# EAGLE design Turnouts_R2 (EAGLE 9.4.2)

## Sheet 1 of 2
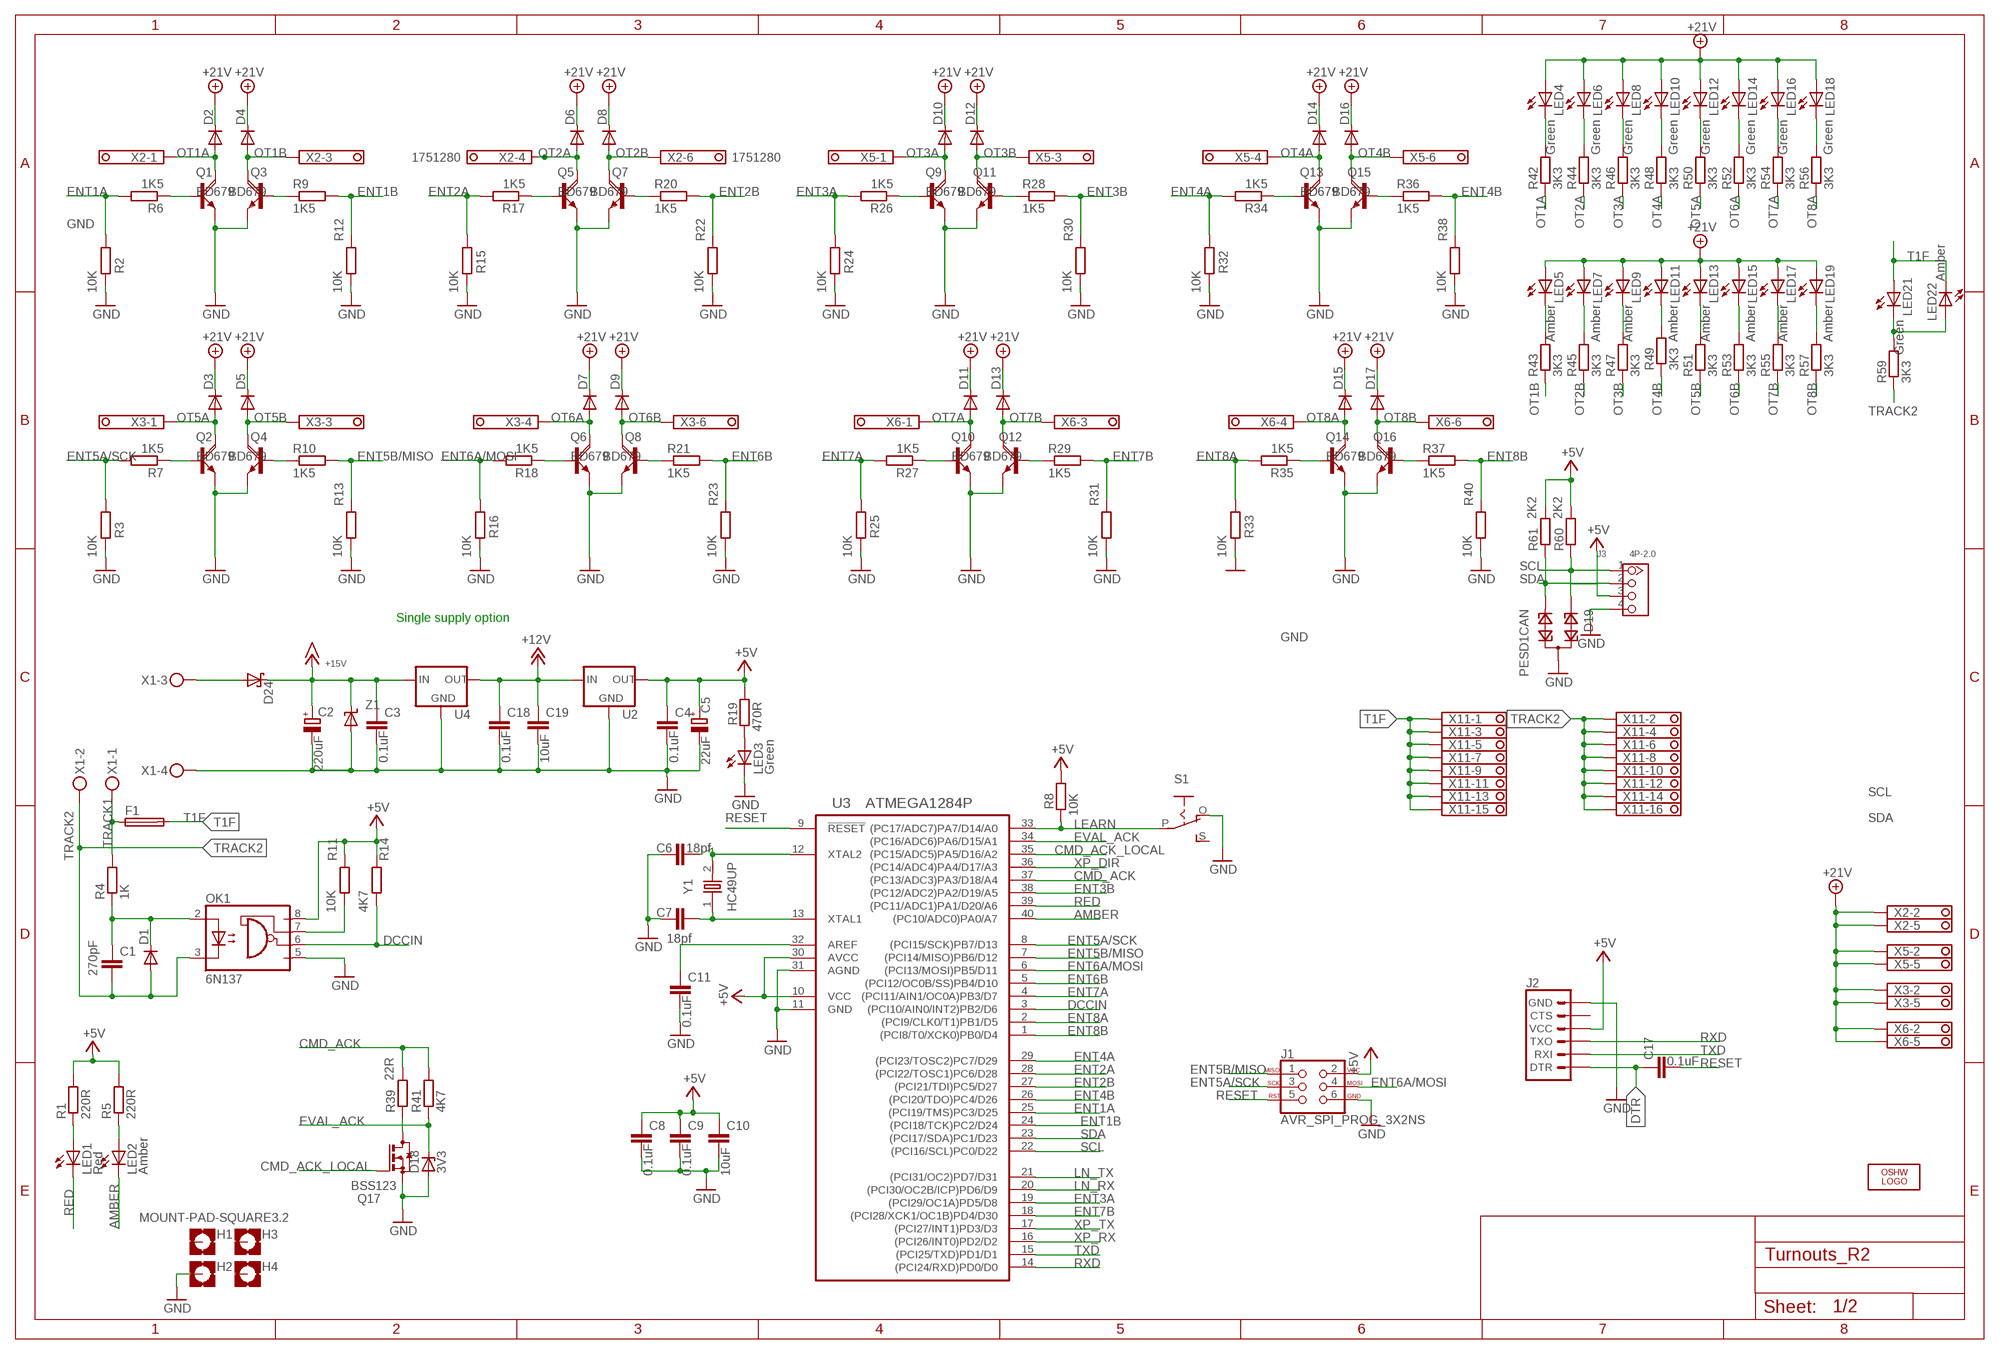
[diagram p0: schematic, sheet 1]

### Parts
C1  270pF  C-EUC0805  [C0805]
C2  220uF  CPOL-EUE7.5-16  [E7,5-16]
C3  0.1uF  C-EUC0805  [C0805]
C4  0.1uF  C-EUC0805  [C0805]
C5  22uF  CPOL-EUE2.5-5  [E2,5-5]
C6  18pf  C-EUC0603  [C0603]
C7  18pf  C-EUC0603  [C0603]
C8  0.1uF  C-EUC0805  [C0805]
C9  0.1uF  C-EUC0805  [C0805]
C10  10uF  C-EUC0805  [C0805]
C11  0.1uF  C-EUC0805  [C0805]
C17  0.1uF  C-EUC0805  [C0805]
C18  0.1uF  C-EUC0805  [C0805]
C19  10uF  C-EUC0805  [C0805]
D1  CGRM4002-G  [SOD-123_MINI-SMA]
D2  CGRM4002-G  [SOD-123_MINI-SMA]
D3  CGRM4002-G  [SOD-123_MINI-SMA]
D4  CGRM4002-G  [SOD-123_MINI-SMA]
D5  CGRM4002-G  [SOD-123_MINI-SMA]
D6  CGRM4002-G  [SOD-123_MINI-SMA]
D7  CGRM4002-G  [SOD-123_MINI-SMA]
D8  CGRM4002-G  [SOD-123_MINI-SMA]
D9  CGRM4002-G  [SOD-123_MINI-SMA]
D10  CGRM4002-G  [SOD-123_MINI-SMA]
D11  CGRM4002-G  [SOD-123_MINI-SMA]
D12  CGRM4002-G  [SOD-123_MINI-SMA]
D13  CGRM4002-G  [SOD-123_MINI-SMA]
D14  CGRM4002-G  [SOD-123_MINI-SMA]
D15  CGRM4002-G  [SOD-123_MINI-SMA]
D16  CGRM4002-G  [SOD-123_MINI-SMA]
D17  CGRM4002-G  [SOD-123_MINI-SMA]
D18  3V3  ZENER-DIODESOT23  [SOT23]
D19  PESD1CAN  [SOT23]
D24  MICROSMD-SCHOTTKY-DIODESMP  [SMP]
F1  TE5  [TE5]
H1  MOUNT-PAD-SQUARE3.2  [3,2-PAD-SQUARE]
H2  MOUNT-PAD-SQUARE3.2  [3,2-PAD-SQUARE]
H3  MOUNT-PAD-SQUARE3.2  [3,2-PAD-SQUARE]
H4  MOUNT-PAD-SQUARE3.2  [3,2-PAD-SQUARE]
J1  AVR_SPI_PROG_3X2NS  [2X3-NS]
J2  6_PIN_SERIAL_TARGET  [1X06]
J3  4P-2.0  GROVE-CONNECTOR-DIP(4P-2.0)  [HW4-2.0]
LED1  Red  LED3MM  [LED3MM]
LED2  Amber  LED3MM  [LED3MM]
LED3  Green  LED3MM  [LED3MM]
LED4  Green  LED3MM  [LED3MM]
LED5  Amber  LED3MM  [LED3MM]
LED6  Green  LED3MM  [LED3MM]
LED7  Amber  LED3MM  [LED3MM]
LED8  Green  LED3MM  [LED3MM]
LED9  Amber  LED3MM  [LED3MM]
LED10  Green  LED3MM  [LED3MM]
LED11  Amber  LED3MM  [LED3MM]
LED12  Green  LED3MM  [LED3MM]
LED13  Amber  LED3MM  [LED3MM]
LED14  Green  LED3MM  [LED3MM]
LED15  Amber  LED3MM  [LED3MM]
LED16  Green  LED3MM  [LED3MM]
LED17  Amber  LED3MM  [LED3MM]
LED18  Green  LED3MM  [LED3MM]
LED19  Amber  LED3MM  [LED3MM]
LED21  Green  LED3MM  [LED3MM]
LED22  Amber  LED3MM  [LED3MM]
LOGO1  OSHW_LOGO_6MILX0200-NT  [OSHW_6X200_NOTEXT]
OK1  6N137  [DIL08]
Q1  BD679  [TO126AV]
Q2  BD679  [TO126AV]
Q3  BD679  [TO126AV]
Q4  BD679  [TO126AV]
Q5  BD679  [TO126AV]
Q6  BD679  [TO126AV]
Q7  BD679  [TO126AV]
Q8  BD679  [TO126AV]
Q9  BD679  [TO126AV]
Q10  BD679  [TO126AV]
Q11  BD679  [TO126AV]
Q12  BD679  [TO126AV]
Q13  BD679  [TO126AV]
Q14  BD679  [TO126AV]
Q15  BD679  [TO126AV]
Q16  BD679  [TO126AV]
Q17  BSS123  [SOT23]
R1  220R  R-EU_R0805  [R0805]
R2  10K  R-EU_R0805  [R0805]
R3  10K  R-EU_R0805  [R0805]
R4  1K  R-EU_R0805  [R0805]
R5  220R  R-EU_R0805  [R0805]
R6  1K5  R-EU_R0805  [R0805]
R7  1K5  R-EU_R0805  [R0805]
R8  10K  R-EU_R0805  [R0805]
R9  1K5  R-EU_R0805  [R0805]
R10  1K5  R-EU_R0805  [R0805]
R11  10K  R-EU_R0805  [R0805]
R12  10K  R-EU_R0805  [R0805]
R13  10K  R-EU_R0805  [R0805]
R14  4K7  R-EU_R0805  [R0805]
R15  10K  R-EU_R0805  [R0805]
R16  10K  R-EU_R0805  [R0805]
R17  1K5  R-EU_R0805  [R0805]
R18  1K5  R-EU_R0805  [R0805]
R19  470R  R-EU_R0805  [R0805]
R20  1K5  R-EU_R0805  [R0805]
R21  1K5  R-EU_R0805  [R0805]
R22  10K  R-EU_R0805  [R0805]
R23  10K  R-EU_R0805  [R0805]
R24  10K  R-EU_R0805  [R0805]
R25  10K  R-EU_R0805  [R0805]
R26  1K5  R-EU_R0805  [R0805]
R27  1K5  R-EU_R0805  [R0805]
R28  1K5  R-EU_R0805  [R0805]
R29  1K5  R-EU_R0805  [R0805]
R30  10K  R-EU_R0805  [R0805]
R31  10K  R-EU_R0805  [R0805]
R32  10K  R-EU_R0805  [R0805]
R33  10K  R-EU_R0805  [R0805]
R34  1K5  R-EU_R0805  [R0805]
R35  1K5  R-EU_R0805  [R0805]
R36  1K5  R-EU_R0805  [R0805]
R37  1K5  R-EU_R0805  [R0805]
R38  10K  R-EU_R0805  [R0805]
R39  22R  R-EU_R0805  [R0805]
R40  10K  R-EU_R0805  [R0805]
R41  4K7  R-EU_R0805  [R0805]
R42  3K3  R-EU_R0805  [R0805]
R43  3K3  R-EU_R0805  [R0805]
R44  3K3  R-EU_R0805  [R0805]
R45  3K3  R-EU_R0805  [R0805]
R46  3K3  R-EU_R0805  [R0805]
R47  3K3  R-EU_R0805  [R0805]
R48  3K3  R-EU_R0805  [R0805]
R49  3K3  R-EU_R0805  [R0805]
R50  3K3  R-EU_R0805  [R0805]
R51  3K3  R-EU_R0805  [R0805]
R52  3K3  R-EU_R0805  [R0805]
R53  3K3  R-EU_R0805  [R0805]
R54  3K3  R-EU_R0805  [R0805]
R55  3K3  R-EU_R0805  [R0805]
R56  3K3  R-EU_R0805  [R0805]
R57  3K3  R-EU_R0805  [R0805]
R59  3K3  R-EU_R0805  [R0805]
R60  2K2  R-EU_R0805  [R0805]
R61  2K2  R-EU_R0805  [R0805]
S1  EG1218S  [EG1218]
U2  V_REG_78XX-TO-220  [TO-220-ALT]
U3  ATMEGA1284P  [DIP40]
U4  V_REG_78XX-TO-220  [TO-220-ALT]
X1  MKDSN1,5/4-5,08  [MKDSN1,5/4-5,08]
X2  1751280  [1751280]
X3  1751280  [1751280]
X5  1751280  [1751280]
X6  1751280  [1751280]
X11  MKKDS1/8-3,5  [MKKDS1/8-3,5]
Y1  HC49UP  [HC49UP]
Z1  TRANSZORB  [SMB]

### Nets
+5V: C4.1 C5.+ C8.1 C9.1 C10.1 J1.2 J2.4(VCC) J3.3 OK1.8(VCC) R1.2 R5.2 R8.2 R11.2 R14.2 R19.2 R60.2 R61.2 U2.OUT U3.10(VCC) U3.30(AVCC) ; also sheet 2
+12V: C18.1 C19.1 U2.IN U4.OUT ; also sheet 2
+15V: C2.+ C3.1 D24.C U4.IN Z1.1(C) ; also sheet 2
+21V: D2.C D3.C D4.C D5.C D6.C D7.C D8.C D9.C D10.C D11.C D12.C D13.C D14.C D15.C D16.C D17.C LED4.A LED5.A LED6.A LED7.A LED8.A LED9.A LED10.A LED11.A LED12.A LED13.A LED14.A LED15.A LED16.A LED17.A LED18.A LED19.A X2.2 X2.5 X3.2 X3.5 X5.2 X5.5 X6.2 X6.5 ; also sheet 2
AMBER: LED2.K(C) U3.40((PC10/ADC0)PA0/A7)
CMD_ACK: R39.2 R41.2 U3.37((PC13/ADC3)PA3/D18/A4) ; also sheet 2
CMD_ACK_LOCAL: Q17.1(G) U3.35((PC15/ADC5)PA5/D16/A2)
DCCIN: OK1.6(VO) R14.1 U3.3((PCI10/AIN0/INT2)PB2/D6)
DTR: C17.1 J2.1(DTR)
ENT1A: R2.2 R6.2 U3.25((PCI19/TMS)PC3/D25)
ENT1B: R9.2 R12.2 U3.24((PCI18/TCK)PC2/D24)
ENT2A: R15.2 R17.2 U3.28((PCI22/TOSC1)PC6/D28)
ENT2B: R20.2 R22.2 U3.27((PCI21/TDI)PC5/D27)
ENT3A: R24.2 R26.2 U3.19((PCI29/OC1A)PD5/D8)
ENT3B: R28.2 R30.2 U3.38((PC12/ADC2)PA2/D19/A5)
ENT4A: R32.2 R34.2 U3.29((PCI23/TOSC2)PC7/D29)
ENT4B: R36.2 R38.2 U3.26((PCI20/TDO)PC4/D26)
ENT5A/SCK: J1.3 R3.2 R7.2 U3.8((PCI15/SCK)PB7/D13)
ENT5B/MISO: J1.1 R10.2 R13.2 U3.7((PCI14/MISO)PB6/D12)
ENT6A/MOSI: J1.4 R16.2 R18.2 U3.6((PCI13/MOSI)PB5/D11)
ENT6B: R21.2 R23.2 U3.5((PCI12/OC0B/SS)PB4/D10)
ENT7A: R25.2 R27.2 U3.4((PCI11/AIN1/OC0A)PB3/D7)
ENT7B: R29.2 R31.2 U3.18((PCI28/XCK1/OC1B)PD4/D30)
ENT8A: R33.2 R35.2 U3.2((PCI9/CLK0/T1)PB1/D5)
ENT8B: R37.2 R40.2 U3.1((PCI8/T0/XCK0)PB0/D4)
EVAL_ACK: D18.3(C) R41.1 U3.34((PC16/ADC6)PA6/D15/A1)
GND: C2.- C3.2 C4.2 C5.- C6.1 C7.1 C8.2 C9.2 C10.2 C11.2 C18.2 C19.2 D18.1(A) D19.3 H2.B3,2(MOUNT) J1.6 J2.6(GND) J3.4 LED3.K(C) OK1.5(GND) Q1.E Q2.E Q3.E Q4.E Q5.E Q6.E Q7.E Q8.E Q9.E Q10.E Q11.E Q12.E Q13.E Q14.E Q15.E Q16.E Q17.2(S) R2.1 R3.1 R12.1 R13.1 R15.1 R16.1 R22.1 R23.1 R24.1 R25.1 R30.1 R31.1 R32.1 R33.1 R38.1 R40.1 S1.O U2.GND U3.11(GND) U3.31(AGND) U4.GND X1.4 Z1.2(A) ; also sheet 2
LEARN: R8.1 S1.P U3.33((PC17/ADC7)PA7/D14/A0)
LN_RX: U3.20((PCI30/OC2B/ICP)PD6/D9) ; also sheet 2
LN_TX: U3.21((PCI31/OC2)PD7/D31) ; also sheet 2
N$1: D24.A X1.3
N$2: C1.1 D1.C OK1.2(A) R4.1
N$4: OK1.7(VE) R11.1
N$5: Q5.B R17.1
N$6: LED13.K(C) R51.2
N$7: Q1.B R6.1
N$8: Q7.B R20.1
N$9: LED15.K(C) R53.2
N$11: Q17.3(D) R39.1
N$12: Q9.B R26.1
N$13: LED17.K(C) R55.2
N$14: LED19.K(C) R57.2
N$15: LED5.K(C) R43.2
N$16: LED7.K(C) R45.2
N$17: LED9.K(C) R47.2
N$18: LED11.K(C) R49.2
N$19: LED4.K(C) R42.2
N$21: LED6.K(C) R44.2
N$23: LED8.K(C) R46.2
N$24: LED10.K(C) R48.2
N$25: LED12.K(C) R50.2
N$26: LED14.K(C) R52.2
N$30: LED16.K(C) R54.2
N$31: LED18.K(C) R56.2
N$32: LED21.K(C) LED22.A R59.2
N$34: Q11.B R28.1
N$36: Q13.B R34.1
N$37: Q15.B R36.1
N$39: Q2.B R7.1
N$40: Q3.B R9.1
N$41: Q4.B R10.1
N$42: LED3.A R19.1
N$43: LED1.A R1.1
N$44: LED2.A R5.1
N$45: Q6.B R18.1
N$46: Q8.B R21.1
N$47: Q10.B R27.1
N$48: Q12.B R29.1
N$49: Q14.B R35.1
N$50: Q16.B R37.1
N$52: C6.2 U3.12(XTAL2) Y1.2
N$53: C7.2 U3.13(XTAL1) Y1.1
N$55: C11.1 U3.32(AREF)
OT1A: D2.A Q1.C R42.1 X2.1
OT1B: D4.A Q3.C R43.1 X2.3
OT2A: D6.A Q5.C R44.1 X2.4
OT2B: D8.A Q7.C R45.1 X2.6
OT3A: D10.A Q9.C R46.1 X5.1
OT3B: D12.A Q11.C R47.1 X5.3
OT4A: D14.A Q13.C R48.1 X5.4
OT4B: D16.A Q15.C R49.1 X5.6
OT5A: D3.A Q2.C R50.1 X3.1
OT5B: D5.A Q4.C R51.1 X3.3
OT6A: D7.A Q6.C R52.1 X3.4
OT6B: D9.A Q8.C R53.1 X3.6
OT7A: D11.A Q10.C R54.1 X6.1
OT7B: D13.A Q12.C R55.1 X6.3
OT8A: D15.A Q14.C R56.1 X6.4
OT8B: D17.A Q16.C R57.1 X6.6
RED: LED1.K(C) U3.39((PC11/ADC1)PA1/D20/A6)
RESET: C17.2 J1.5 U3.9(!RESET) ; also sheet 2
RXD: J2.3(TXO) U3.14((PCI24/RXD)PD0/D0)
SCL: D19.1 J3.1 R60.1 U3.22((PCI16/SCL)PC0/D22) ; also sheet 2
SDA: D19.2 J3.2 R61.1 U3.23((PCI17/SDA)PC1/D23) ; also sheet 2
T1F: F1.2 LED21.A LED22.K(C) X11.1 X11.3 X11.5 X11.7 X11.9 X11.11 X11.13 X11.15
TRACK1: F1.1 R4.2 X1.1
TRACK2: C1.2 D1.A OK1.3(C) R59.1 X1.2 X11.2 X11.4 X11.6 X11.8 X11.10 X11.12 X11.14 X11.16
TXD: J2.2(RXI) U3.15((PCI25/TXD)PD1/D1)
XP_DIR: U3.36((PC14/ADC4)PA4/D17/A3) ; also sheet 2
XP_RX: U3.16((PCI26/INT0)PD2/D2) ; also sheet 2
XP_TX: U3.17((PCI27/INT1)PD3/D3) ; also sheet 2
Unconnected: H1.B3,2(MOUNT) H3.B3,2(MOUNT) H4.B3,2(MOUNT) J2.5(CTS) S1.S

### Notes on the sheet
- Single supply option

## Sheet 2 of 2
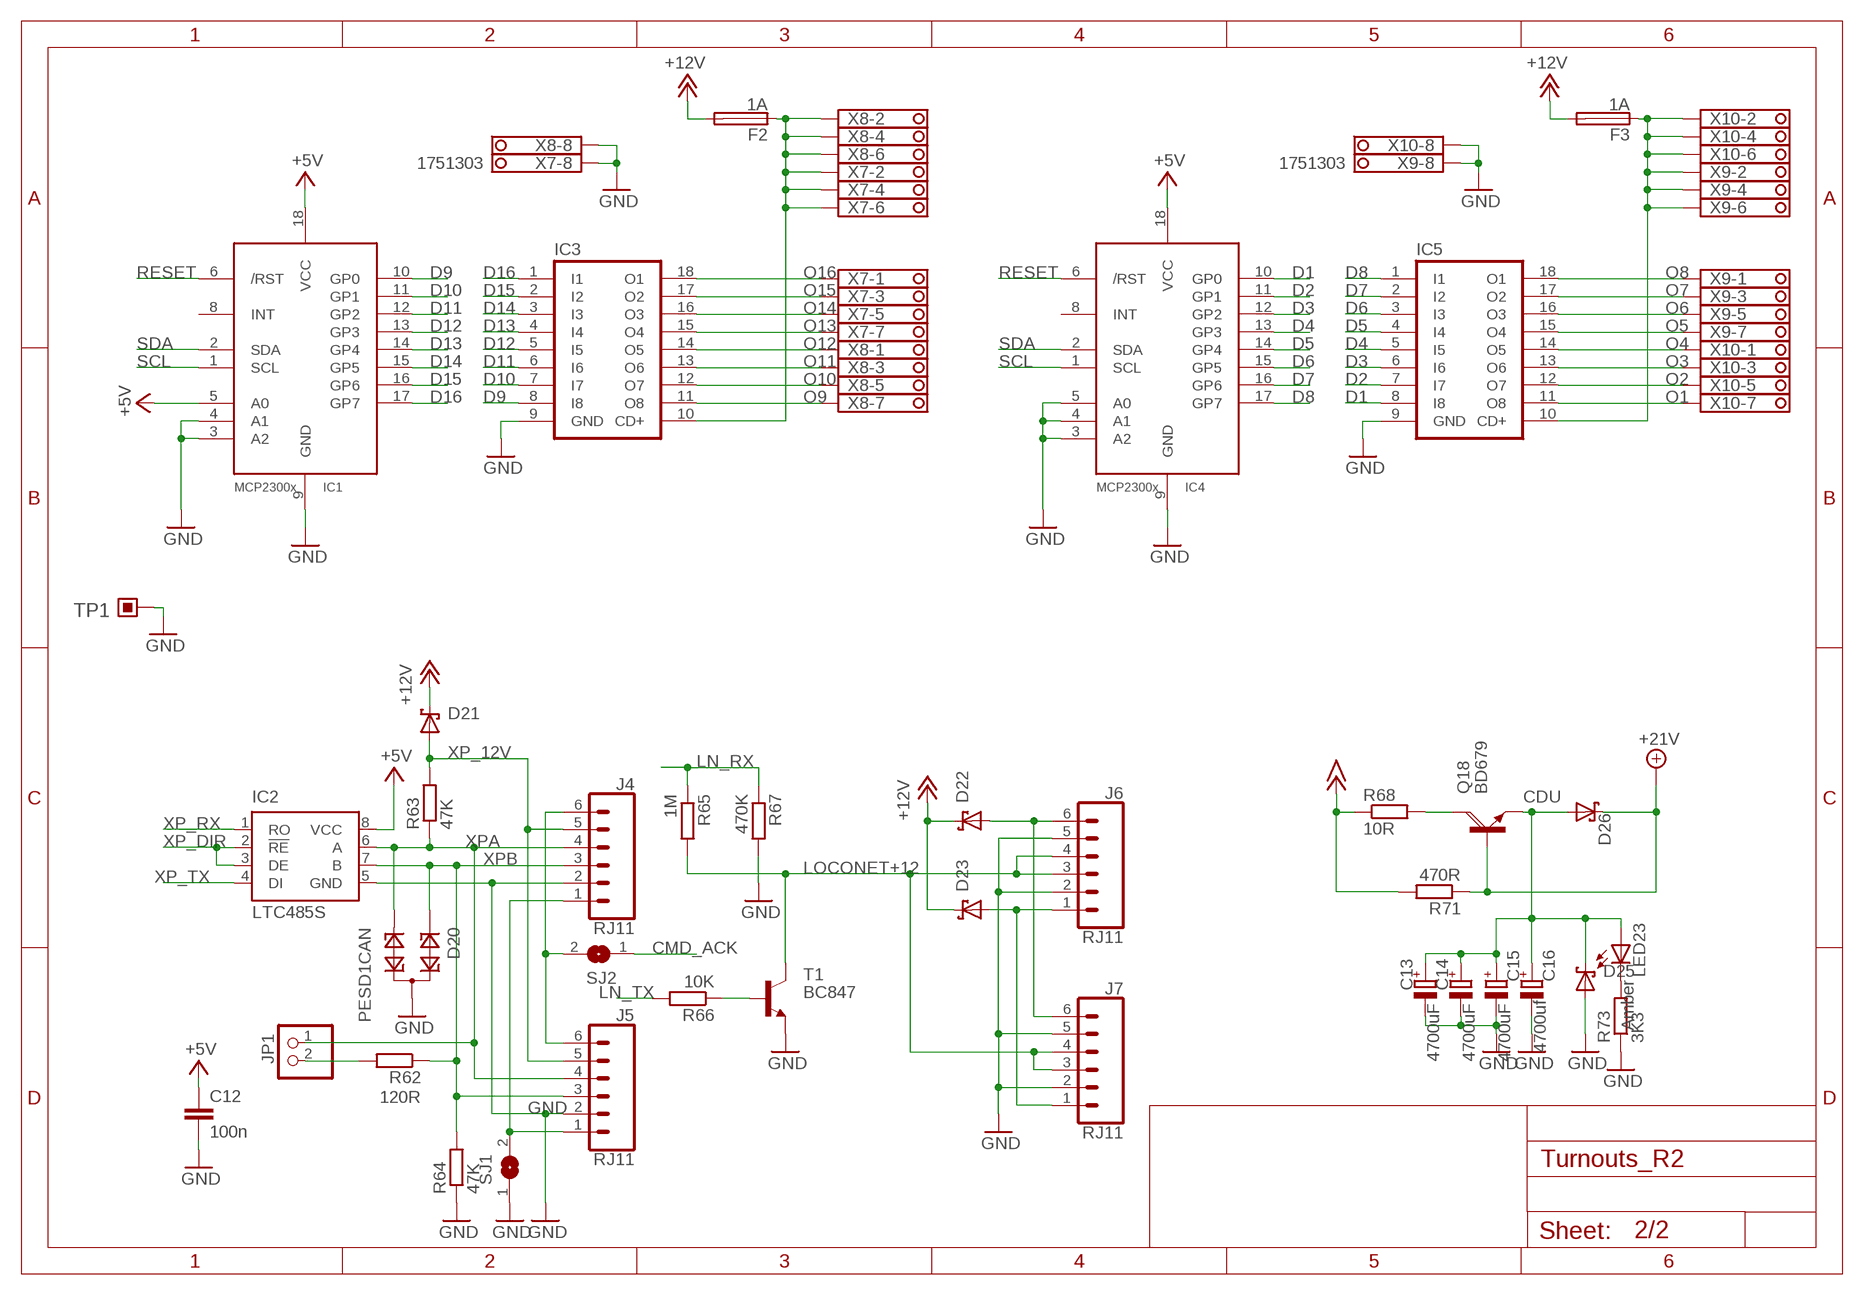
[diagram p1: schematic, sheet 2]

### Parts
C12  100n  C-EUC0805  [C0805]
C13  4700uF  CPOL-EUE7.5-16  [E7,5-16]
C14  4700uF  CPOL-EUE7.5-16  [E7,5-16]
C15  4700uF  CPOL-EUE7.5-16  [E7,5-16]
C16  4700uf  CPOL-EUE7.5-16  [E7,5-16]
D20  PESD1CAN  [SOT23]
D21  MICROSMD-SCHOTTKY-DIODESMP  [SMP]
D22  MICROSMD-SCHOTTKY-DIODESMP  [SMP]
D23  MICROSMD-SCHOTTKY-DIODESMP  [SMP]
D25  MICROSMD-SCHOTTKY-DIODESMP  [SMP]
D26  MICROSMD-SCHOTTKY-DIODESMP  [SMP]
F2  1A  TE5  [TE5]
F3  1A  TE5  [TE5]
IC1  MCP23008/P  [DIL18]
IC2  LTC485S  [SOIC8]
IC3  ULN2803A  [DIL18]
IC4  MCP23008/P  [DIL18]
IC5  ULN2803A  [DIL18]
J4  RJ11  RJ11-6  [RJ11-6]
J5  RJ11  RJ11-6  [RJ11-6]
J6  RJ11  RJ11-6  [RJ11-6]
J7  RJ11  RJ11-6  [RJ11-6]
JP1  PINHD-1X2  [1X02]
LED23  Amber  LED3MM  [LED3MM]
Q18  BD679  [TO126AV]
R62  120R  R-EU_R0805  [R0805]
R63  47K  R-EU_R0805  [R0805]
R64  47K  R-EU_R0805  [R0805]
R65  1M  R-EU_R0805  [R0805]
R66  10K  R-EU_R0805  [R0805]
R67  470K  R-EU_R0805  [R0805]
R68  10R  R-EU_0617/22  [0617/22]
R71  470R  R-EU_0411/12  [0411/12]
R73  3K3  R-EU_R0805  [R0805]
SJ1  SJ  [SJ]
SJ2  SJ  [SJ]
T1  BC847  [SOT23]
TP1  TP1.5RUND  [TP-1.5RUND]
X7  1751303  [1751303]
X8  1751303  [1751303]
X9  1751303  [1751303]
X10  1751303  [1751303]

### Nets
+5V: C12.1 IC1.5(A0) IC1.18(VCC) IC2.8(VCC) IC4.18(VCC) ; also sheet 1
+12V: D21.C D22.C D23.C F2.2 F3.2 ; also sheet 1
+15V: R68.1 R71.2 ; also sheet 1
+21V: D26.C Q18.B R71.1 ; also sheet 1
CDU: C13.+ C14.+ C15.+ C16.+ D25.C D26.A LED23.A Q18.E
CMD_ACK: SJ2.1 ; also sheet 1
D1: IC4.10(GP0) IC5.8(I8)
D2: IC4.11(GP1) IC5.7(I7)
D3: IC4.12(GP2) IC5.6(I6)
D4: IC4.13(GP3) IC5.5(I5)
D5: IC4.14(GP4) IC5.4(I4)
D6: IC4.15(GP5) IC5.3(I3)
D7: IC4.16(GP6) IC5.2(I2)
D8: IC4.17(GP7) IC5.1(I1)
D9: IC1.10(GP0) IC3.8(I8)
D10: IC1.11(GP1) IC3.7(I7)
D11: IC1.12(GP2) IC3.6(I6)
D12: IC1.13(GP3) IC3.5(I5)
D13: IC1.14(GP4) IC3.4(I4)
D14: IC1.15(GP5) IC3.3(I3)
D15: IC1.16(GP6) IC3.2(I2)
D16: IC1.17(GP7) IC3.1(I1)
GND: C12.2 C13.- C14.- C15.- C16.- D20.3 D25.A IC1.3(A2) IC1.4(A1) IC1.9(GND) IC2.5(GND) IC3.9(GND) IC4.3(A2) IC4.4(A1) IC4.5(A0) IC4.9(GND) IC5.9(GND) J4.2 J5.2 J6.2 J6.5 J7.2 J7.5 R64.1 R67.2 R73.1 SJ1.1 T1.2(E) TP1.1 X7.8 X8.8 X9.8 X10.8 ; also sheet 1
LN_RX: R65.1 R67.1 ; also sheet 1
LN_TX: R66.2 ; also sheet 1
LOCONET+12: J6.3 J6.4 J7.3 J7.4 R65.2 T1.3(C)
N$10: J4.1 J5.1 SJ1.2
N$20: LED23.K(C) R73.2
N$22: Q18.C R68.2
N$27: D23.A J6.1 J7.1
N$28: J4.6 J5.6 SJ2.2
N$29: F2.1 IC3.10(CD+) X7.2 X7.4 X7.6 X8.2 X8.4 X8.6
N$33: JP1.2 R62.2
N$38: F3.1 IC5.10(CD+) X9.2 X9.4 X9.6 X10.2 X10.4 X10.6
N$51: D22.A J6.6 J7.6
N$54: R66.1 T1.1(B)
O1: IC5.11(O8) X10.7
O2: IC5.12(O7) X10.5
O3: IC5.13(O6) X10.3
O4: IC5.14(O5) X10.1
O5: IC5.15(O4) X9.7
O6: IC5.16(O3) X9.5
O7: IC5.17(O2) X9.3
O8: IC5.18(O1) X9.1
O9: IC3.11(O8) X8.7
O10: IC3.12(O7) X8.5
O11: IC3.13(O6) X8.3
O12: IC3.14(O5) X8.1
O13: IC3.15(O4) X7.7
O14: IC3.16(O3) X7.5
O15: IC3.17(O2) X7.3
O16: IC3.18(O1) X7.1
RESET: IC1.6(/RST) IC4.6(/RST) ; also sheet 1
SCL: IC1.1(SCL) IC4.1(SCL) ; also sheet 1
SDA: IC1.2(SDA) IC4.2(SDA) ; also sheet 1
XP_12V: D21.A J4.5 J5.5 R63.2
XP_DIR: IC2.2(!RE) IC2.3(DE) ; also sheet 1
XP_RX: IC2.1(RO) ; also sheet 1
XP_TX: IC2.4(DI) ; also sheet 1
XPA: D20.2 IC2.6(A) J4.4 J5.4 JP1.1 R63.1
XPB: D20.1 IC2.7(B) J4.3 J5.3 R62.1 R64.2
Unconnected: IC1.8(INT) IC4.8(INT)

## Library data of the parts
C1 C3 C4 C8-C11 C17-C19 = rcl:C-EU: CAPACITOR, European symbol; SPICEPREFIX: C
C2 C5 = rcl:CPOL-EU: POLARIZED CAPACITOR, European symbol; SPICEPREFIX: C
C6 C7 C12 = rcl:C-EU: CAPACITOR, European symbol
C13-C16 = rcl:CPOL-EU: POLARIZED CAPACITOR, European symbol
D1-D17 = diode:CGRM400*-G: Molded plasitc,JEDEC SOD-123/Mini SMA Source: Comchip CGRM4001-G.pdf
D18 = diode:ZENER-DIODE: Z-Diode
D19 D20 = diode:PESD1CAN: CAN bus ESD protection diode Source: http://www.nxp.com/documents/data_sheet/PESD1CAN.pdf
D21-D26 = GJR:MICROSMD-SCHOTTKY-DIODE: SMP variant; FARNELL: 1812493; MANUFACTURER: Vishay; PARTNUM: SS3PX
F1-F3 = fuse:TE5: FUSE Wickmann; OC_FARNELL: unknown; OC_NEWARK: unknown
H1-H4 = holes:MOUNT-PAD-SQUARE: MOUNTING PAD, square
IC1 IC4 = adafruit:MCP23008: MCP23008 Inexpensive i2c i/o expander - 8 general purpose i/o pins with optional pullups
IC2 = linear-technology:LTC485: Low Power RS485 Interface Transceiver Source: http://www.linear.com/pc/downloadDocument.do?navId=H0,C1,C1007,C1017,P2064,D1718; OC_FARNELL: unknown; OC_NEWARK: unknown
IC3 IC5 = uln-udn:ULN2803A: DRIVER ARRAY
J1 = SparkFun-Connectors:AVR_SPI_PROG_3X2: AVR ISP 6 Pin This is the reduced ISP connector for AVR programming. Common on Arduino. This footprint will take up less PCB space and can be used with a 10-pin to 6-pin adapter such as SKU: BOB-08508 **Special note about "TEST_POINT" package. The stop mask is on the top side, so if you want your programming test points to be on the bottom of your board, make sure to place this package on the bottom side of the board. This also ensure that the orientation to program from the bottom side will be correct. SparkFun Products: SparkFun ISP Pogo Adapter <https://www.sparkfun.com/products/11591> - NS Tiny AVR Programmer <https://www.sparkfun.com/products/11801> -PTH
J2 = SparkFun-Connectors:6_PIN_SERIAL_TARGET: 6-pin header connection for use with the "FTDI BASIC" pinout - TARGET SIDE. Also known as "Arduino Serial Program Header". It is used to mate with our FTDI Basic serial programmers using the Arduino IDE. Note, this device has "TARGET" in the name. It is intended to be used on a design that contains a target micro-controller that you wish to program. The "sister" device, named "CABLE" is inteneded to be used on a design that usually lives on the end of your USB cable and prvides the converter chip (FTDI232 or FTDI231x) to commnicate serial RX/TX. You can populate with some of these: Break Away Headers - Straight <https://www.sparkfun.com/products/116> (PRT-00116) For reference (or to suit your programming needs) check out these designs: SparkFun FTDI Basic Breakout - 5V <https://www.sparkfun.com/products/9716> (DEV-09716) SparkFun FTDI Basic Breakout - 3.3V <https://www.sparkfun.com/products/9873> (DEV-09873) SparkFun FTDI SmartBasic <https://www.sparkfun.com/products/12935> (DEV-12935) SparkFun Beefy 3 - FTDI Basic Breakout <https://www.sparkfun.com/products/13746> (DEV-13746)
J3 = Seeed-Connector:GROVE-CONNECTOR-DIP(4P-2.0): 320110033
J4-J7 = SparkFun-Connectors:RJ11-6: RJ11 Jack - 6 pin Commonly found on CAT3 devices and some Microchip programmers. Here is the connector we sell at SparkFun: RJ11 6-Pin Connector <https://www.sparkfun.com/products/132> (PRT-00132) Datasheet <http://www.sparkfun.com/datasheets/Prototyping/Connectors/RJ11-Datasheet.pdf> It is used on this SparkFun product: SparkFun Weather Shield <https://www.sparkfun.com/products/12081> (DEV-12081) Weather Meters <https://www.sparkfun.com/products/8942> (SEN-08942); PROD_ID: CONN-08590; SF_ID: PRT-00132
JP1 = pinhead:PINHD-1X2: PIN HEADER
LED1-LED19 LED21-LED23 = adafruit:LED: LED OSRAM: - CHIPLED LG R971, LG N971, LY N971, LG Q971, LY Q971, LO R971, LY R971 LH N974, LH R974 LS Q976, LO Q976, LY Q976 LO Q996 - Hyper CHIPLED LW Q18S LB Q993, LB Q99A, LB R99A - SideLED LS A670, LO A670, LY A670, LG A670, LP A670 LB A673, LV A673, LT A673, LW A673 LH A674 LY A675 LS A676, LA A676, LO A676, LY A676, LW A676 LS A679, LY A679, LG A679 - Hyper Micro SIDELED® LS Y876, LA Y876, LO Y876, LY Y876 LT Y87S - SmartLED LW L88C, LW L88S LB L89C, LB L89S, LG L890 LS L89K, LO L89K, LY L89K LS L896, LA L896, LO L896, LY L896 - TOPLED LS T670, LO T670, LY T670, LG T670, LP T670 LSG T670, LSP T670, LSY T670, LOP T670, LYG T670 LG T671, LOG T671, LSG T671 LB T673, LV T673, LT T673, LW T673 LH T674 LS T676, LA T676, LO T676, LY T676, LB T676, LH T676, LSB T676, LW T676 LB T67C, LV T67C, LT T67C, LS T67K, LO T67K, LY T67K, LW E67C LS E67B, LA E67B, LO E67B, LY E67B, LB E67C, LV E67C, LT E67C LW T67C LS T679, LY T679, LG T679 LS T770, LO T770, LY T770, LG T770, LP T770 LB T773, LV T773, LT T773, LW T773 LH T774 LS E675, LA E675, LY E675, LS T675 LS T776, LA T776, LO T776, LY T776, LB T776 LHGB T686 LT T68C, LB T68C - Hyper Mini TOPLED® LB M676 - Mini TOPLED Santana® LG M470 LS M47K, LO M47K, LY M47K Source: http://www.osram.convergy.de/
LOGO1 = ohw-logo:OSHW_LOGO_6MIL
OK1 = optocoupler:6N137: MOTOROLA OPTO COUPLER; MPN: 6N137; OC_FARNELL: 1328376; OC_NEWARK: 52M1895
Q1-Q16 Q18 = transistor-power:BD679: NPN DARLINGTON TRANSISTOR
Q17 = transistor-small-signal:BSS123: N-CHANNEL MOS FET
R1-R57 R59-R68 R71 R73 = rcl:R-EU_: RESISTOR, European symbol
S1 = adafruit:EG1218: SLIDING SWITCH 0.1" spacing through hole, vertical SPDT slide switch http://www.ladyada.net/library/pcb/eaglelibrary.html
SJ1 SJ2 = jumper:SJ: SMD solder JUMPER
T1 = nxp_60:BC847: 45 V, 100 mA NPN general-purpose transistors NPN general-purpose transistor AAL Eindhoven MK
TP1 = RCLDT:TP
U2 U4 = SparkFun-IC-Power:V_REG_78XX: Voltage Regulator Standard 78xx regulator. IGO (Input Ground Output). Spark Fun Electronics SKU : COM-00107; PROD_ID: VREG-08450; SF_ID: COM-00107
U3 = GJR:ATMEGA1284P: ATMEL ATMEGA 1284P; FARNELL: 1972067; MANUFACTURER: Microchip; PARTNUMBER: ATMEGA1284-P
X1 = con-phoenix-508:MKDSN1,5/4-5,08: MKDSN 1,5/ 4-5,08 Printklemme Nennstrom: 13,5 A Nennspannung: 250 V Rastermaß: 5,08 mm Polzahl: 4 Anschlussart: Schraubanschluss Montage: Löten Anschlussrichtung Leiter/Platine: 0 ° Artikelnummer: 1729144 Source: http://eshop.phoenixcontact.com .. 1729144.pdf; MPN: SMKDSN1,5/4-5,08; OC_FARNELL: 1792905; OC_NEWARK: 70R0300
X2 X3 X5 X6 = con-phoenix-350:1751280: MKDS 1/ 6-3,5 Printklemme Nennstrom: 10 A Bemessungsspannung: 160 V Raster: 3,5 mm Polzahl: 6 Montageart: Löten Anschlussart: Schraubanschluss Anschlussrichtung vom Leiter zur Platine: 0° Source: http://eshop.phoenixcontact.com .. 1751280.pdf; MPN: 1751280; OC_FARNELL: unknown; OC_NEWARK: 27R1765
X7-X10 = con-phoenix-350:1751303: MKDS 1/ 8-3,5 Printklemme Nennstrom: 10 A Bemessungsspannung: 160 V Raster: 3,5 mm Polzahl: 8 Montageart: Löten Anschlussart: Schraubanschluss Anschlussrichtung vom Leiter zur Platine: 0° Source: http://eshop.phoenixcontact.com .. .pdf; OC_FARNELL: unknown; OC_NEWARK: unknown
X11 = con-phoenix-350:MKKDS1/8-3,5: MKKDS 1/8-3,5 Artikelnummer: 1751455 Printklemme, Nennstrom: 8 A, Nennspannung: 200 V, Rastermaß: 3,5 mm, Polzahl: 13 Anschlussart: Schraubanschluss, Montage: Löten, Anschlussrichtung Leiter/Platine: 0 °, Farbe: grün Home page <http://www.phoenixcontact.de/>
Y1 = GJR:HC49UP: HC49 SMD Crystal
Z1 = GJR:TRANSZORB; VOLTAGE: 15V

## Net classes
0 default: clearance 0.205 mm
1 pwr: width 0.2 mm, drill 0.3 mm, clearance 0.205 mm to class 0, clearance 0.205 mm
2 gnd: width 0.2 mm, drill 0.3 mm, clearance 0.2 mm

## Board
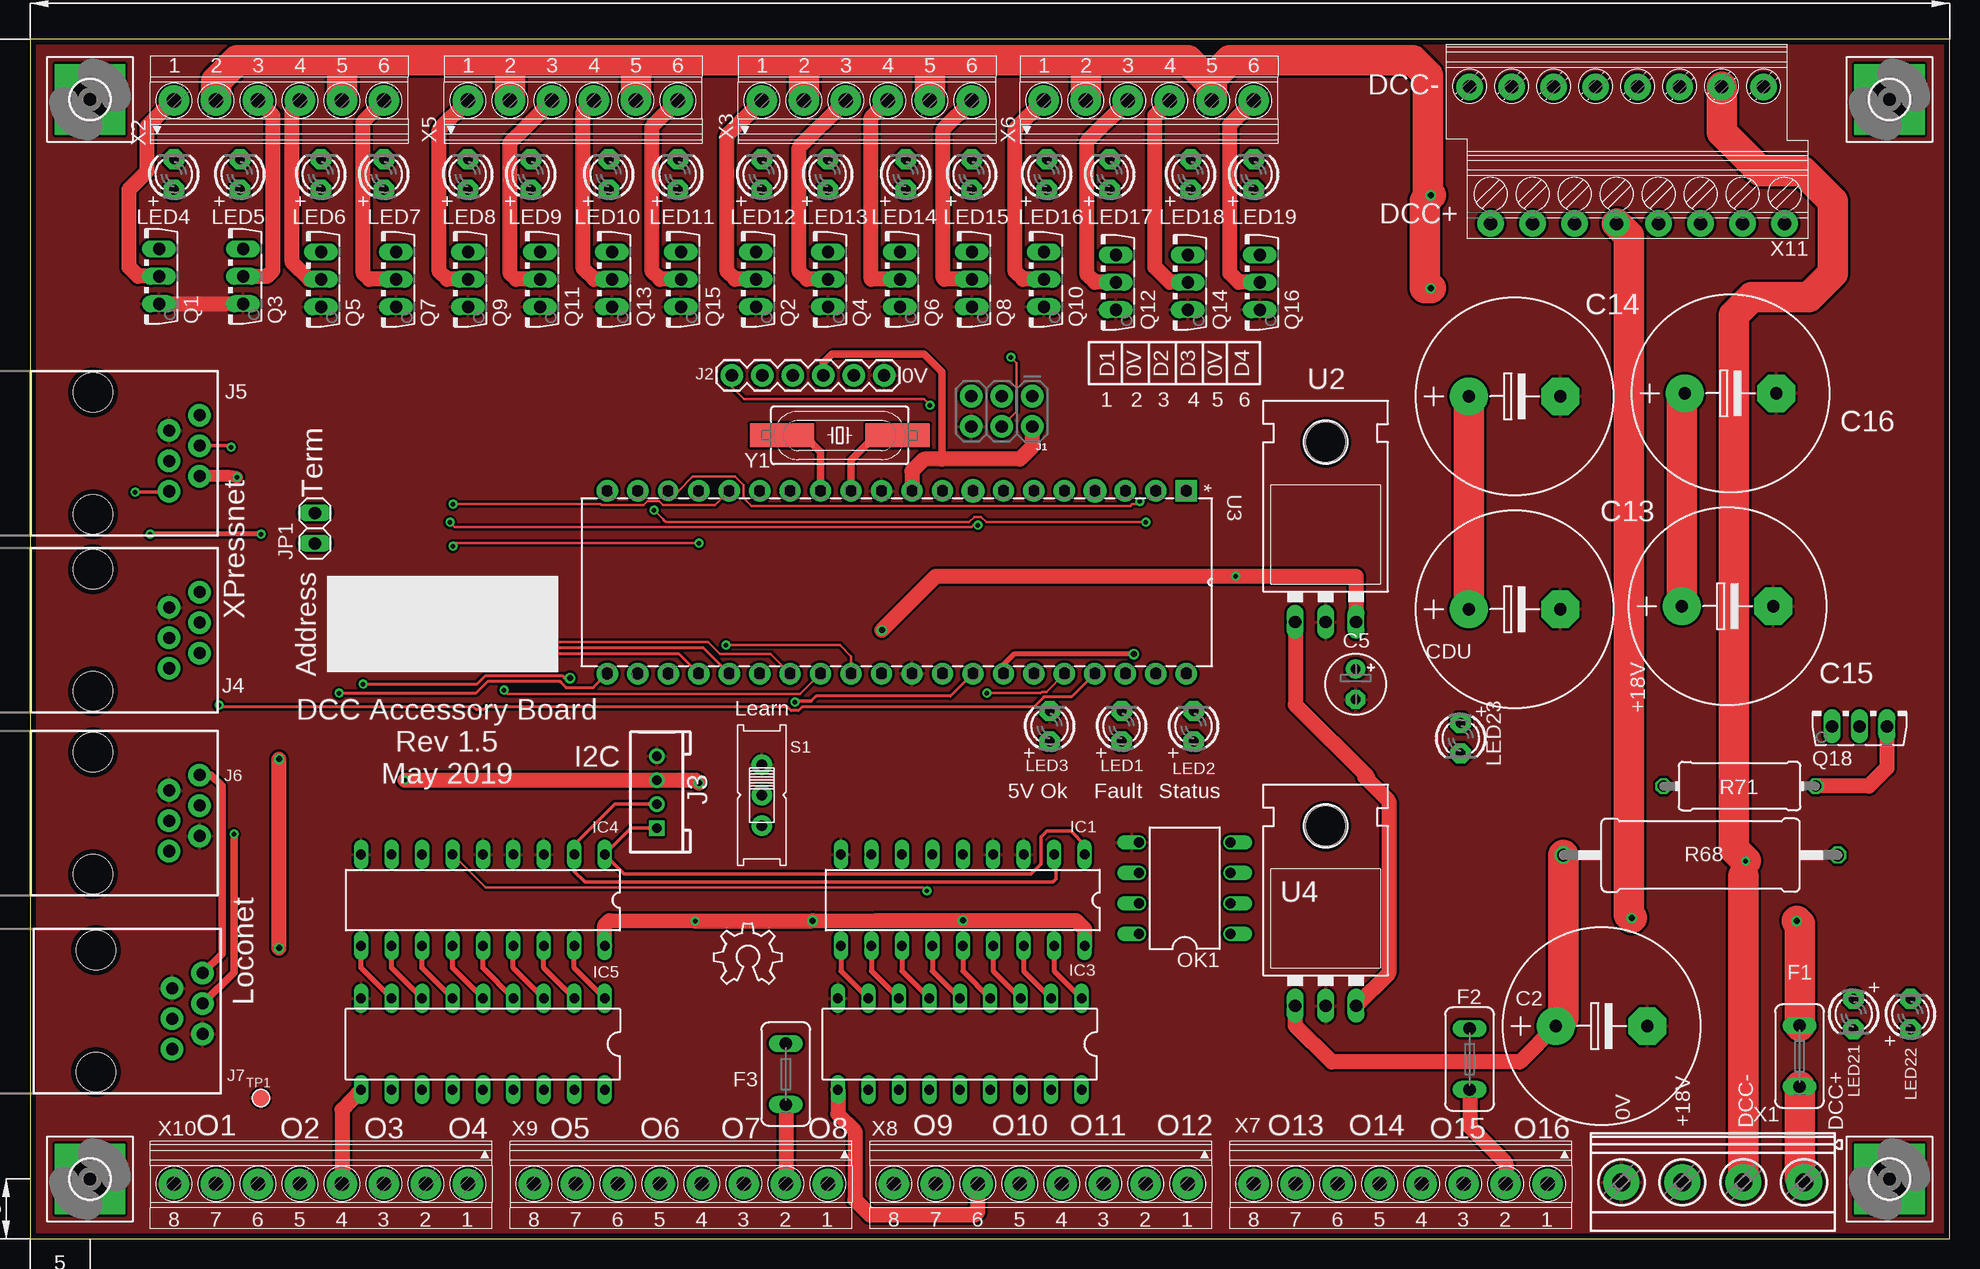
[diagram p2: board, top side]
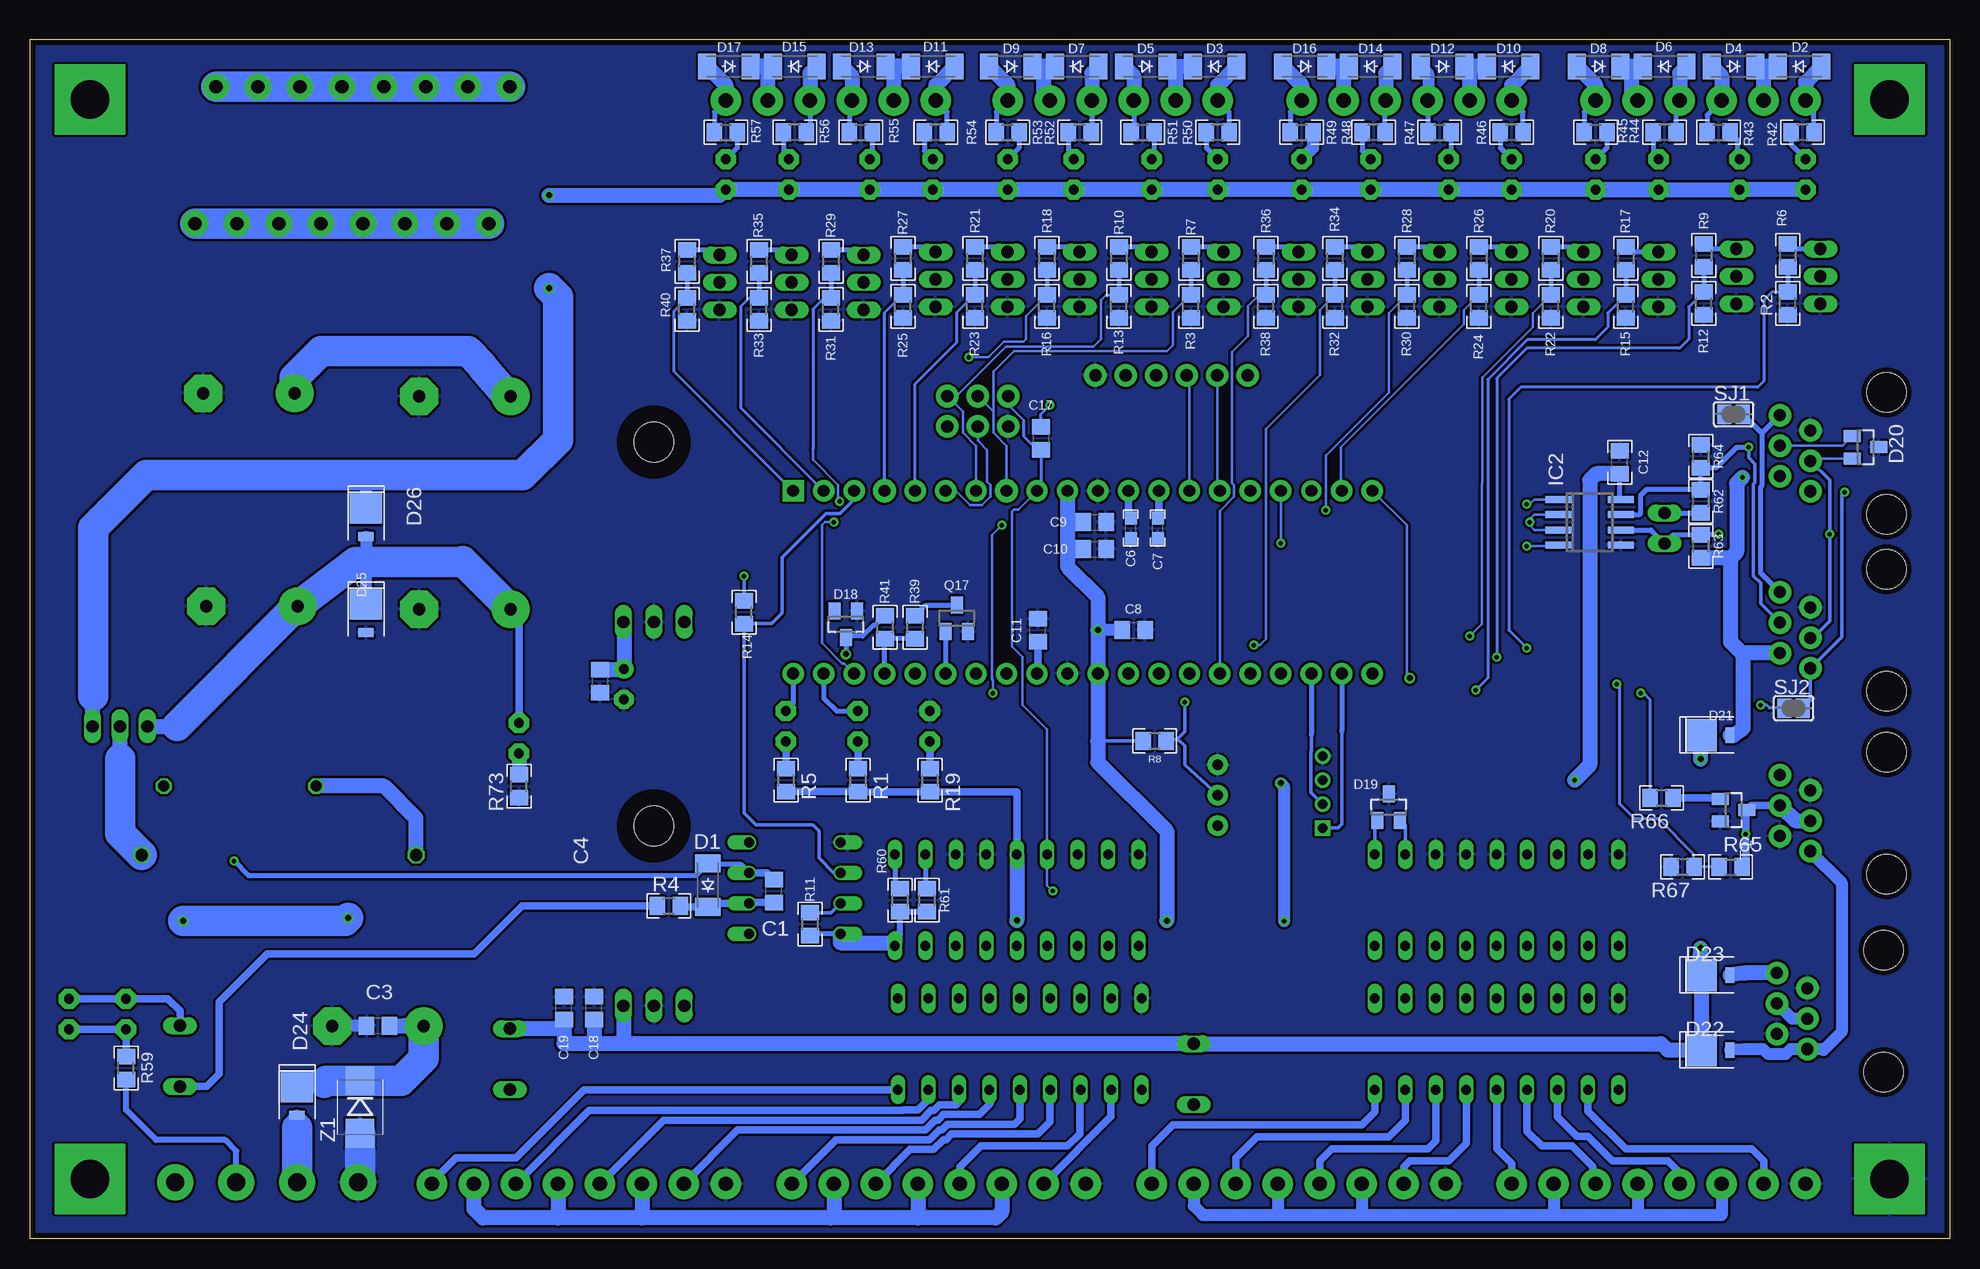
[diagram p3: board, bottom side, seen from below]

Size 160 x 100 mm. Coordinates in mm from the lower left corner, seen from the top.
Outline: 0,0 160,0 160,100 0,100 0,0
Copper layers (1*16): Top 0.035mm / dielectric 1.55mm / Bottom 0.035mm
Design rules "eC-STANDARD_pool-2-layer-35Ê-base-copper": minimum track width 0.15mm, minimum drill 0.25mm, track to track 0.2mm, track to pad 0.2mm, pad to pad 0.2mm, via to via 0.2mm, smd to smd 0.2mm, copper to edge 0.45mm, drill to drill 0.3mm, minimum pad ring 0.2mm, minimum via ring 0.2mm, stop-mask expansion 0.1mm, vias tented up to drill 0mil, thermal gap 0.2mm

### Footprints (pad centres in the part's own frame; a part is rotated, then mirrored left to right if it is on the bottom)
C0805 = smd 1.3 x 1.5: 1 -0.95,0; 2 0.95,0
E7,5-16 = drill 1.016 pad 3.15: + -3.81,0 | drill 1.016 pad 3.15 octagon: - 3.81,0
E2,5-5 = drill 0.813 pad 1.6: + -1.27,0 | drill 0.813 pad 1.6 octagon: - 1.27,0
C0603 = smd 1.1 x 1: 1 -0.85,0; 2 0.85,0
SOD-123_MINI-SMA = smd 1.5 x 2.1: A 1.8,0; C -1.8,0
SOT23 = smd 1 x 1.4: 1 -0.95,-1.1; 2 0.95,-1.1; 3 0,1.1
SMP = smd 0.762 x 1.27: A 0.699,0 | smd 2.54 x 2.7: C -1.653,0
TE5 = drill 1.016 long: 1 -2.54,0; 2 2.54,0
3,2-PAD-SQUARE = drill 3.2 pad 5.842 square: B3,2 0,0
DIL18 = drill 0.813 long: 1 -10.16,-3.81; 2 -7.62,-3.81; 3 -5.08,-3.81; 4 -2.54,-3.81; 5 0,-3.81; 6 2.54,-3.81; 7 5.08,-3.81; 8 7.62,-3.81; 9 10.16,-3.81; 10 10.16,3.81; 11 7.62,3.81; 12 5.08,3.81; 13 2.54,3.81; 14 0,3.81; 15 -2.54,3.81; 16 -5.08,3.81; 17 -7.62,3.81; 18 -10.16,3.81
SOIC8 = smd 0.6 x 2.2: 1 -1.905,-2.6; 2 -0.635,-2.6; 3 0.635,-2.6; 4 1.905,-2.6; 5 1.905,2.6; 6 0.635,2.6; 7 -0.635,2.6; 8 -1.905,2.6
2X3-NS = drill 1.016 pad 1.88: 1 -2.54,-1.27; 2 -2.54,1.27; 3 0,-1.27; 4 0,1.27; 5 2.54,-1.27; 6 2.54,1.27
1X06 = drill 1.016 pad 1.88: 1 0,0; 2 2.54,0; 3 5.08,0; 4 7.62,0; 5 10.16,0; 6 12.7,0
HW4-2.0 = drill 0.8 pad 1.27 square: 1 -3,0 | drill 0.8 pad 1.27: 2 -1,0; 3 1,0; 4 3,0
RJ11-6 = drill 1.016 pad 1.88: 1 -3.175,8.89; 2 -1.905,6.35; 3 -0.635,8.89; 4 0.635,6.35; 5 1.905,8.89; 6 3.175,6.35 | hole 3.251: -5.08,0; 5.08,0
1X02 = drill 1.016 long: 1 -1.27,0; 2 1.27,0
LED3MM = drill 0.813 pad 1.676 octagon: A -1.27,0; K 1.27,0
DIL08 = drill 0.813 offset: 1 -3.81,-3.81; 2 -1.27,-3.81; 3 1.27,-3.81; 4 3.81,-3.81; 5 3.81,3.81; 6 1.27,3.81; 7 -1.27,3.81; 8 -3.81,3.81
TO126AV = drill 1.016 long: B 2.286,-1.27; C 0,-1.27; E -2.286,-1.27
R0805 = smd 1.3 x 1.5: 1 -0.95,0; 2 0.95,0
0617/22 = drill 1.016 octagon: 1 -11.43,0; 2 11.43,0
0411/12 = drill 0.914 octagon: 1 -6.35,0; 2 6.35,0
EG1218 = drill 0.9 pad 1.676: O -2.54,0; P 0,0; S 2.54,0
SJ = smd 1.168 x 1.6: 1 -0.762,0; 2 0.762,0
TP-1.5RUND = smd 1.5 x 1.5: 1 0,0
TO-220-ALT = drill 1.016 long: GND 0,-3.81; IN -2.54,-3.81; OUT 2.54,-3.81 | hole 3.302: 0,11.176
DIP40 = drill 0.991 pad 1.778 square: 1 -7.62,24.13 | drill 0.991 pad 1.778: 2 -7.62,21.59; 3 -7.62,19.05; 5 -7.62,13.97; 6 -7.62,11.43; 7 -7.62,8.89; 9 -7.62,3.81; 10 -7.62,1.27; 11 -7.62,-1.27; 12 -7.62,-3.81; 13 -7.62,-6.35; 14 -7.62,-8.89; 15 -7.62,-11.43; 16 -7.62,-13.97; 17 -7.62,-16.51; 19 -7.62,-21.59; 20 -7.62,-24.13; 21 7.62,-24.13; 22 7.62,-21.59; 23 7.62,-19.05; 24 7.62,-16.51; 25 7.62,-13.97; 26 7.62,-11.43; 27 7.62,-8.89; 28 7.62,-6.35; 29 7.62,-3.81; 30 7.62,-1.27; 31 7.62,1.27; 32 7.62,3.81; 33 7.62,6.35; 34 7.62,8.89; 35 7.62,11.43; 36 7.62,13.97; 37 7.62,16.51; 38 7.62,19.05; 39 7.62,21.59; 40 7.62,24.13 | drill 0.991 pad 1.93: 4 -7.62,16.51; 8 -7.62,6.35 | drill 0.991 pad 1.676: 18 -7.62,-19.05
MKDSN1,5/4-5,08 = drill 1.5 pad 3: 1 -7.641,0.025; 2 -2.561,0.025; 3 2.519,0.025; 4 7.599,0.025
1751280 = drill 1.2 pad 2.54: 1 -8.75,-0.1; 2 -5.25,-0.1; 3 -1.75,-0.1; 4 1.75,-0.1; 5 5.25,-0.1; 6 8.75,-0.1
1751303 = drill 1.2 pad 2.54: 1 -12.25,-0.1; 2 -8.75,-0.1; 3 -5.25,-0.1; 4 -1.75,-0.1; 5 1.75,-0.1; 6 5.25,-0.1; 7 8.75,-0.1; 8 12.25,-0.1
MKKDS1/8-3,5 = drill 1.1 pad 2.2: 1 -12.25,6.85; 2 -10.5,-4.55; 3 -8.75,6.85; 4 -7,-4.55; 5 -5.25,6.85; 6 -3.5,-4.55; 7 -1.75,6.85; 8 0,-4.55; 9 1.75,6.85; 10 3.5,-4.55; 11 5.25,6.85; 12 7,-4.55; 13 8.75,6.85; 14 10.5,-4.55; 15 12.25,6.85; 16 14,-4.55
HC49UP = smd 5.334 x 1.93: 1 -4.826,0; 2 4.826,0
SMB = smd 2.4 x 2.4: 1 -2.2,0; 2 2.2,0

### Placement (x,y rotation side)
C1  98,29 90 bottom
C2  131,17.75 0 top
C3  131,17.75 180 bottom
C4  112.5,46.5 270 bottom
C5  110.5,46.25 270 top
C6  68.25,59.25 90 bottom
C7  66,59.25 90 bottom
C8  68,50.75 0 bottom
C9  71.25,59.75 0 bottom
C10  71.25,57.5 0 bottom
C11  76,50.75 90 bottom
C12  27.5,64.75 90 bottom
C13  123.75,52.5 0 top
C14  123.75,70.25 0 top
C15  141.5,52.75 0 top
C16  141.75,70.5 0 top
C17  75.75,66.75 270 bottom
C18  113,19.25 90 bottom
C19  115.5,19.25 90 bottom
D1  103.5,29.5 90 bottom
D2  12.5,97.75 0 bottom
D3  61.25,97.75 0 bottom
D4  18,97.75 180 bottom
D5  67,97.75 180 bottom
D6  23.75,97.75 0 bottom
D7  72.75,97.75 0 bottom
D8  29.25,97.75 180 bottom
D9  78.25,97.75 180 bottom
D10  36.75,97.75 0 bottom
D11  84.75,97.75 0 bottom
D12  42.25,97.75 180 bottom
D13  90.5,97.75 180 bottom
D14  48.25,97.75 0 bottom
D15  96.25,97.75 0 bottom
D16  53.75,97.75 180 bottom
D17  101.75,97.75 180 bottom
D18  92,51.25 180 bottom
D19  46.75,36 0 bottom
D20  7,66 270 bottom
D21  19,42 0 bottom
D22  19,15.75 0 bottom
D23  19,22 0 bottom
D24  137.75,11 270 bottom
D25  132,51.25 270 bottom
D26  132,59.25 270 bottom
F1  147.5,15.25 90 top
F2  120,15 90 top
F3  63,13.75 90 top
H1  5,95 0 top
H2  5,5 0 top
H3  155,95 0 top
H4  155,5 0 top
IC1  77.75,28.25 180 top
IC2  30,59.75 270 bottom
IC3  77.5,16.25 180 top
IC4  37.75,28.25 180 top
IC5  37.75,16.25 180 top
J1  81,69 180 top
J2  58.5,72 0 top
J3  52.25,37.25 90 top
J4  5.25,50.75 270 top
J5  5.25,65.5 270 top
J6  5.25,35.5 270 top
J7  5.5,19 270 top
JP1  23.75,59.25 90 top
LED1  91,42.75 90 top
LED2  97,42.75 90 top
LED3  85,42.75 90 top
LED4  12,88.75 90 top
LED5  17.5,88.75 90 top
LED6  24.25,88.75 90 top
LED7  29.5,88.75 90 top
LED8  36.5,88.75 90 top
LED9  41.75,88.75 90 top
LED10  48.25,88.75 90 top
LED11  54,88.75 90 top
LED12  61,88.75 90 top
LED13  66.5,88.75 90 top
LED14  73,88.75 90 top
LED15  78.5,88.75 90 top
LED16  84.75,88.75 90 top
LED17  90,88.75 90 top
LED18  96.75,88.75 90 top
LED19  102,88.75 90 top
LED21  152,18.75 270 top
LED22  156.75,18.75 90 top
LED23  119.25,41.75 270 top
LOGO1  57,21.25 0 top
OK1  96.25,29.25 90 top
Q1  9.5,80.25 90 top
Q2  59.25,80 90 top
Q3  16.5,80.25 90 top
Q4  65.25,80 90 top
Q5  23,80 90 top
Q6  71.25,80 90 top
Q7  29.25,80 90 top
Q8  77.25,80 90 top
Q9  35.25,80 90 top
Q10  83.25,80 90 top
Q11  41.25,80 90 top
Q12  89.25,79.75 90 top
Q13  47.25,80 90 top
Q14  95.25,79.75 90 top
Q15  53,80 90 top
Q16  101.25,79.75 90 top
Q17  82.75,51.75 0 bottom
Q18  152.5,44 0 top
R1  91,38.25 270 bottom
R2  13.5,78 90 bottom
R3  63.25,77.75 90 bottom
R4  106.75,27.75 180 bottom
R5  97,38.25 270 bottom
R6  13.5,82 270 bottom
R7  63.25,81.75 270 bottom
R8  66.25,41.5 180 bottom
R9  20.5,82 270 bottom
R10  69.25,81.75 270 bottom
R11  95,26.25 270 bottom
R12  20.5,78 90 bottom
R13  69.25,77.75 90 bottom
R14  100.5,52.25 90 bottom
R15  27,77.75 90 bottom
R16  75.25,77.75 90 bottom
R17  27,81.75 270 bottom
R18  75.25,81.75 270 bottom
R19  85,38.25 270 bottom
R20  33.25,81.75 270 bottom
R21  81.25,81.75 270 bottom
R22  33.25,77.75 90 bottom
R23  81.25,77.75 90 bottom
R24  39.25,77.75 90 bottom
R25  87.25,77.75 90 bottom
R26  39.25,81.75 270 bottom
R27  87.25,81.75 270 bottom
R28  45.25,81.75 270 bottom
R29  93.25,81.5 270 bottom
R30  45.25,77.75 90 bottom
R31  93.25,77.5 90 bottom
R32  51.25,77.75 90 bottom
R33  99.25,77.5 90 bottom
R34  51.25,81.75 270 bottom
R35  99.25,81.5 270 bottom
R36  57,81.75 270 bottom
R37  105.25,81.5 270 bottom
R38  57,77.75 90 bottom
R39  86.25,51 270 bottom
R40  105.25,77.5 90 bottom
R41  88.75,51 270 bottom
R42  12.25,92.25 180 bottom
R43  19.25,92.25 0 bottom
R44  23.75,92.25 180 bottom
R45  29.5,92.25 0 bottom
R46  36.5,92.25 180 bottom
R47  42.5,92.25 0 bottom
R48  48,92.25 180 bottom
R49  54,92.25 0 bottom
R50  61,92.25 180 bottom
R51  67.25,92.25 0 bottom
R52  72.5,92.25 180 bottom
R53  78.5,92.25 0 bottom
R54  84.5,92.25 180 bottom
R55  90.75,92.25 0 bottom
R56  96.25,92.25 180 bottom
R57  102,92.25 0 bottom
R59  152,14.25 90 bottom
R60  87.5,28.25 270 bottom
R61  85.25,28.25 270 bottom
R62  20.75,61.5 270 bottom
R63  20.75,57.75 270 bottom
R64  20.75,65.25 270 bottom
R65  18.25,31 0 bottom
R66  24,36.75 180 bottom
R67  22.25,31 180 bottom
R68  139.25,32 0 top
R71  142.5,37.75 180 top
R73  119.25,37.75 90 bottom
S1  61,37 270 top
SJ1  18,68.75 0 bottom
SJ2  13,44.25 0 bottom
T1  18,35.75 270 bottom
TP1  19.25,11.75 0 top
U2  108,55.25 0 top
U3  72.25,54.75 270 top
U4  108,23.25 0 top
X1  140.25,4.75 180 top
X2  20.75,95 0 top
X3  69.75,95 0 top
X5  45.25,95 0 top
X6  93.25,95 0 top
X7  114.25,4.5 180 top
X8  84.25,4.5 180 top
X9  54.25,4.5 180 top
X10  24.25,4.5 180 top
X11  134,91.5 180 top
Y1  67.5,67 0 top
Z1  132.5,11 270 bottom

### Tracks (layer width: path | path; a pad name or v marks a point on that pad's centre or on a via)
+5V  (via drill 0.35, 0.5)
  Top 0.61: 76,65 76,72.25 74.5,73.75 66.87,73.75 66.12,73 J2.4
  Top 1.27: IC4.18 47.91,26.16 48.29,26.54 v55.46,26.5 v65.25,26.53 70.5,26.54 v77.75,26.54 87.21,26.54 87.91,25.84 IC1.18 | U3.10 73.5,62.39 73.5,64 74.5,65 76,65 82.5,65 83.54,66.04 J1.2 | v55.75,38 55.5,38.25 J3.3 v31.25,38.25 | v71,50.75 75.5,55.25 v100.5,55.25 110.54,55.25 U2.OUT
  Bottom 0.305: R8.2 70.98,41.5 | R14.2 v100.5,55.25
  Bottom 0.406: IC2.8 27.5,61.76 C12.1 | OK1.8 94.86,25.44 R11.2
  Bottom 0.508: R61.2 R60.2 87.5,24.85 IC1.18
  Bottom 0.61: IC1.5 77.75,37.25 85.05,37.25 | R5.2 R1.2 90.95,37.25 85.05,37.25 | 85.05,37.25 R19.2
  Bottom 1.016: v55.75,38 55.46,37.71 v55.46,26.5 | C8.1 v71,50.75 | C10.1 72.9,57.4 73.52,58.02 | C9.1 73.52,59.75
  Bottom 1.27: IC1.18 88.16,24.69 92.44,24.69 OK1.8 | IC1.5 v77.75,26.54 | U2.OUT 110.5,51.4 C5.+ 110.57,47.45 C4.1 | U3.10 73.52,59.75 73.52,58.02 73.52,56.02 71,53.5 v71,50.75 71,47.15 U3.30 70.98,41.5 70.98,39.73 65.25,34 v65.25,26.53 | C12.1 29.45,63.8 30,63.25 30,39.5 v31.25,38.25 | v65.25,26.53
+12V  (via drill 0.5)
  Top 1.27: v20.75,24.25 v20.75,40 | U2.IN 105.46,44.54 111.5,38.5 111.25,38.5 113.25,36.5 113.25,22.15 U4.OUT
  Bottom 1.27: 110.5,16.29 F3.2 24.04,16.29 23.5,15.75 D22.C D23.C 20.8,23.7 20.75,23.75 v20.75,24.25 | 110.5,16.29 113,16.29 | 113,16.29 115.5,16.29 115.5,17.54 | 115.5,17.54 F2.2 | v20.75,40 20.75,41.95 D21.C | U4.OUT 110.54,16.33 110.5,16.29 | C18.1 113,16.29 | C19.1 115.5,17.54
+15V
  Top 1.27: C2.+ 124.19,14.74 124.17,14.75 108.5,14.75 105.46,17.79 U4.IN
  Top 2.54: R68.1 127.82,18.38 C2.+
  Bottom 1.016: 135.5,13 137.5,13 137.75,13.25 D24.C
  Bottom 1.27: C3.1 128.84,17.79 C2.+ | R68.1 127.82,35.07 130.5,37.75 R71.2
  Bottom 2.54: C2.+ 127.19,15.06 129.05,13.2 Z1.1 135.3,13.2 135.5,13
+21V  (via drill 0.5)
  Top 1.27: Q18.B 154.79,39.25 153.29,37.75 R71.1
  Top 2.54: X2.2 15.5,96.5 17.25,98.25 25.5,98.25 | 25.5,98.25 40,98.25 | 40,98.25 50.25,98.25 | 50.25,98.25 64.5,98.25 | 64.5,98.25 75.25,98.25 | 75.25,98.25 87.75,98.25 | 87.75,98.25 96.5,98.25 98.5,96.25 X6.5 98.5,96.75 100,98.25 115.25,98.25 116.5,97 116.5,87.25 v116.75,87 116.25,86.5 116.25,79.25 v116.75,79.25 | X2.5 26,97.75 25.5,98.25 | X5.2 40,98.25 | X5.5 50.5,98 50.25,98.25 | X3.2 64.5,98.25 | X3.5 75,98 75.25,98.25 | X6.2 88,98 87.75,98.25
  Bottom 1.016: D26.C 132,63.42 132.25,63.67
  Bottom 1.27: D2.C 15.5,97.75 | 15.5,97.75 D4.C | X2.2 15.5,97.75 | D10.C 39.75,97.75 | 39.75,97.75 D12.C | X5.2 40,97.5 39.75,97.75 | D14.C 51,97.75 | 51,97.75 D16.C | X5.5 50.5,97.25 51,97.75 | X3.2 64.5,97.05 D5.C D3.C | D7.C 75.5,97.75 | 75.5,97.75 D9.C | X3.5 75.5,95.4 75.5,97.75 | D11.C 88,97.75 | 88,97.75 D13.C | X6.2 88,97.75 | D17.C D15.C 98.5,97.3 X6.5 | D6.C 26.5,97.75 | 26.5,97.75 D8.C | X2.5 26.5,95.4 26.5,97.75 | LED4.A LED5.A LED7.A LED6.A LED8.A LED9.A LED10.A LED11.A LED12.A LED13.A LED14.A LED15.A LED16.A LED17.A LED18.A LED19.A 102.48,87 v116.75,87 | Q18.B 154.79,45.21 154.75,45.25
  Bottom 2.54: v116.75,79.25 116,78.5 116,66.6 118.92,63.67 132.25,63.67 150.32,63.67 154.75,59.25 154.75,45.25
AMBER
  Bottom 0.406: U3.40 96.38,44.64 LED2.K
CDU
  Top 2.54: C14.+ C13.+ | C16.+ 137.69,70.25 C15.+
  Bottom 0.61: LED23.A 119.25,51.81 C13.+
  Bottom 1.016: D25.C 132,55.58 132.87,56.45 | D26.A 132,56.95 131.5,56.45
  Bottom 1.27: Q18.E 147.79,42.73 147.73,42.79
  Bottom 2.54: C14.+ 120.17,70.25 122.31,72.74 122.31,72.81 123.5,74 135.75,74 137.94,71.81 C16.+ | C13.+ 123.94,56.5 124.06,56.45 131.5,56.45 132.87,56.45 C15.+ 137.77,52.75 147.73,42.79
CMD_ACK  (via drill 0.35)
  Top 0.254: U3.37 86.82,45.19 84.52,45.19 83.67,44.35 64.35,44.35 64.04,44.04 63.46,44.04 63.13,44.37 38.04,44.37 37.79,44.12 37.21,44.12 36.96,44.37 15.88,44.37 v15.75,44.5
  Bottom 0.254: SJ2.1 15,44.25 15.25,44.5 v15.75,44.5
  Bottom 0.406: U3.37 R41.2 R39.2
CMD_ACK_LOCAL
  Bottom 0.406: Q17.1 83.7,47.15 U3.35
D1
  Top 0.406: IC5.8 27.59,22.6 IC4.10
D2
  Top 0.406: IC5.7 30.13,22.6 IC4.11
D3
  Top 0.406: IC5.6 32.67,22.6 IC4.12
D4
  Top 0.406: IC5.5 35.21,22.6 IC4.13
D5
  Top 0.406: IC5.4 37.75,22.6 IC4.14
D6
  Top 0.406: IC5.3 40.29,22.6 IC4.15
D7
  Top 0.406: IC5.2 42.83,22.6 IC4.16
D8
  Top 0.406: IC5.1 45.37,22.6 IC4.17
D9
  Top 0.406: IC1.10 67.59,22.35 IC3.8
D10
  Top 0.406: IC1.11 70.13,22.35 IC3.7
D11
  Top 0.406: IC1.12 72.67,22.35 IC3.6
D12
  Top 0.406: IC1.13 75.21,22.35 IC3.5
D13
  Top 0.406: IC1.14 77.75,22.35 IC3.4
D14
  Top 0.406: IC1.15 80.29,22.35 IC3.3
D15
  Top 0.406: IC1.16 82.83,22.35 IC3.2
D16
  Top 0.406: IC1.17 85.37,22.35 IC3.1
DCCIN
  Bottom 0.305: OK1.6 93.02,30.52 94.25,31.75 94.25,34 94.75,34.5 99.5,34.5 100.5,35.5 R14.1 98.2,51.3 97.32,52.18 97.32,56.82 93.66,60.49 92.47,60.49 91.3,61.66 U3.3
DTR  (via drill 0.35)
  Top 0.2: J2.1 58.5,71 59.5,70 74.5,70 v75,69.5
  Bottom 0.254: C17.1 75.75,68.75 v75,69.5
ENT1A  (via drill 0.35)
  Top 0.254: U3.25 56.16,49.25 v35.25,49.25
  Bottom 0.254: R2.2 14.8,78.95 15.5,78.25 15.5,71.5 16,71 35.75,71 36.75,70 36.75,50.75 v35.25,49.25
  Bottom 0.406: R6.2 R2.2
ENT1B  (via drill 0.35)
  Top 0.254: U3.24 54.12,48.75 38,48.75 v37.75,48.5
  Bottom 0.254: R12.2 21.75,77.7 21.75,75 22.5,74.25 35.25,74.25 37.75,71.75 v37.75,48.5
  Bottom 0.406: R9.2 R12.2
ENT2A  (via drill 0.35)
  Top 0.203: v39.5,45.75 39.82,45.43 64.2,45.43 U3.28
  Bottom 0.254: R15.2 28.5,77.2 28.5,76 29.54,74.96 35.19,74.96 38.5,71.65 38.5,46.75 v39.5,45.75
  Bottom 0.406: R17.2 R15.2
ENT2B  (via drill 0.35)
  Top 0.203: U3.27 61.74,48.75 57.5,48.75 56.5,49.75 40.5,49.75 v40,50.25
  Bottom 0.2: R22.2 34.75,77.2 34.75,76.01 38.93,71.83 38.93,63.07 39,63
  Bottom 0.203: 39,63 39,51.25 v40,50.25
  Bottom 0.406: R20.2 R22.2
ENT3A
  Bottom 0.2: R24.2 40.5,77.45 40.5,76.25 50.75,66 50.75,62.46 U3.19
  Bottom 0.406: R26.2 R24.2
ENT3B  (via drill 0.35)
  Top 0.2: v93,59.75 79.71,59.75 79.28,60.18 78.72,60.18 78.29,59.75 53,59.75 52.84,59.91 52.75,60 v52,60.75
  Bottom 0.2: U3.38 92.17,47.99 92.31,47.99 94,49.68 94,59.5 93.75,59.75 v93,59.75 | R30.2 46.75,77.2 46.75,70.57 52,65.32 v52,60.75
  Bottom 0.406: R28.2 R30.2
ENT4A  (via drill 0.35)
  Top 0.2: v58,49.5 67.5,49.5 68.44,48.56 U3.29
  Bottom 0.2: R32.2 52.5,77.45 52.5,72 57,67.5 57,50 57.5,49.5 v58,49.5
  Bottom 0.406: R34.2 R32.2
ENT4B
  Bottom 0.2: U3.26 60.82,60.68 59.63,61.88 59.63,62.87 59.8,63.03 59.8,73.95 58.5,75.25 58.5,77.75 57.55,78.7 R38.2
  Bottom 0.406: R36.2 R38.2
ENT5A/SCK
  Bottom 0.2: J1.3 79.7,68.97 | U3.8 78.6,66.11 79.7,67.21 79.7,68.97 | 79.7,68.97 79.7,72.3 78,74 65.25,74 64.75,74.5 64.75,77.25 63.25,78.75
  Bottom 0.406: R7.2 63.25,78.75 R3.2
ENT5B/MISO
  Bottom 0.2: U3.7 81.14,66.11 82.25,67.21 82.25,68.97 J1.1 82.76,70.27 78.62,74.41 71.34,74.41 70.75,75 70.75,78.25 70.3,78.7 R13.2
  Bottom 0.406: R10.2 R13.2
ENT6A/MOSI  (via drill 0.35)
  Top 0.2: v81.75,73.5 81.78,73.5 82.25,73.04 82.25,68.97 J1.4
  Bottom 0.2: J1.4 81,66.54 80.23,65.77 80.23,63.15 79.95,62.87 79.95,61.88 80.64,61.18 81.64,61.18 82.83,62.37 U3.6 | R16.2 77,76.95 77,75 77.19,74.81 78.79,74.81 80.1,73.5 v81.75,73.5
  Bottom 0.406: R18.2 R16.2
ENT6B
  Bottom 0.254: U3.5 86.22,71.28 82.75,74.75 82.75,77.25 81.25,78.75
  Bottom 0.406: R21.2 81.25,78.75 R23.2
ENT7A
  Bottom 0.254: U3.4 88.76,77.24 87.25,78.75
  Bottom 0.406: R27.2 87.25,78.75 R25.2
ENT7B  (via drill 0.35)
  Top 0.2: U3.18 54.05,62.37 55.24,63.56 58.77,63.56 59.47,62.87 59.47,61.78 60.15,61.1 91.72,61.1 91.87,61.25 92.26,61.25 v92.5,61.5
  Bottom 0.2: 94.75,65.82 94.75,64.97 92.65,62.87 92.65,61.65 v92.5,61.5
  Bottom 0.254: 94.75,65.82 94.75,77.5 93.75,78.5 93.25,78.5
  Bottom 0.406: R29.2 93.25,78.5 R31.2
ENT8A
  Bottom 0.254: U3.2 100.75,69.28 100.75,77.75 100.05,78.45 R33.2
  Bottom 0.406: R35.2 R33.2
ENT8B
  Bottom 0.254: R40.2 105.25,78.42 106.33,77.34 106.33,72.32 U3.1
  Bottom 0.406: R37.2 R40.2
EVAL_ACK  (via drill 0.5)
  Top 0.406: v92,48.75 82,48.75 81.14,47.89 U3.34
  Bottom 0.2: 91.9,50.25 D18.3
  Bottom 0.406: R41.1 89.55,51.15 89.69,51.15 90.59,50.25 91.9,50.25 | D18.3 v92,48.75
GND
  Top 1.27: Q1.E Q3.E
  Bottom 1.016: C3.2 C2.-
  Bottom 2.54: Z1.2 132.5,4.88 X1.4
  pour Top: 0.5,99.5 159.5,99.5 159.5,0.21 0.5,0
  pour Bottom: 0.5,99.5 159.5,99.5 159.5,0.05 24.75,0.05 133.75,0 0.5,0
LEARN  (via drill 0.35)
  Top 0.254: U3.33 76.72,45.25 65.53,45.25 65.11,44.83
  Top 0.305: v63.75,44.75 63.83,44.83 65.11,44.83
  Bottom 0.305: R8.1 64.36,41.69 | 64.36,41.69 64.35,41.69 63.75,42.3 v63.75,44.75 | 64.36,41.69 63.75,41.09 63.75,39.5 S1.P
LN_RX  (via drill 0.35, 0.5)
  Top 0.203: v45,46.75 44.75,46.75
  Top 0.254: v27.75,46.25 37.27,46.25 37.98,46.96 44.41,46.96 44.62,46.75 44.75,46.75
  Bottom 0.203: v45,46.75 45.25,47 45.25,59.5 U3.20
  Bottom 0.254: R65.1 R67.1 21.3,32.05 24.25,35 26.25,35 27.5,36.25 27.5,46 v27.75,46.25
LN_TX  (via drill 0.35)
  Top 0.254: v25.75,45.5 37.17,45.5 38.17,46.5 44.22,46.5 44.22,46.43 44.68,45.97 46.96,45.97 U3.21
  Bottom 0.254: R66.2 24.95,44.95 25.5,45.5 v25.75,45.5
LOCONET+12  (via drill 0.35)
  Top 0.61: J7.3 17,22.25 v17,33.75
  Bottom 0.61: J6.3 16.52,36.13 T1.3 17,35.65 v17,33.75 17,31.25 17.25,31 R65.2
  Bottom 1.016: J7.4 13.12,18.36 J7.3
  Bottom 1.27: J6.3 13.43,35.42 13.38,35.42 12.83,34.87 J6.4
N$1
  Bottom 1.016: D24.A 137.75,9.25
  Bottom 2.54: 137.75,9.25 137.75,4.74 X1.3
N$2
  Bottom 0.61: C1.1 99.99,28.05 OK1.2 103.22,27.98 D1.C 105.75,27.7 R4.1
N$4
  Bottom 0.305: OK1.7 93.22,27.2 R11.1
N$5
  Bottom 0.406: Q5.B 26.59,82.29 R17.1
N$6
  Bottom 0.406: R51.2 66.3,90.22 LED13.K
N$7
  Bottom 0.406: Q1.B 13.09,82.54 R6.1
N$8
  Bottom 0.406: Q7.B 30.93,82.7 R20.1
N$9
  Bottom 0.406: R53.2 77.55,90.97 LED15.K
N$10
  Bottom 0.406: J4.1 15.75,55.53 15.75,62.68 15.61,62.82 15.61,67.21 | 15.61,67.21 J5.1 | SJ1.2 15.7,67.21 15.61,67.21
N$11
  Bottom 0.406: R39.1 85.35,52.85 Q17.3
N$12
  Bottom 0.406: Q9.B 36.93,82.7 R26.1
N$13
  Bottom 0.406: R55.2 89.8,90.22 LED17.K
N$14
  Bottom 0.406: R57.2 101.05,90.97 LED19.K
N$15
  Bottom 0.406: R43.2 17.7,91.65 17.7,90.22 LED5.K
N$16
  Bottom 0.406: R45.2 28.55,90.97 LED7.K
N$17
  Bottom 0.406: R47.2 41.55,90.22 LED9.K
N$18
  Bottom 1.016: R49.2 53.05,90.97 LED11.K
N$19
  Bottom 0.406: R42.2 13.2,91.22 LED4.K
N$20
  Bottom 1.27: LED23.K R73.2
N$21
  Bottom 0.406: R44.2 24.7,90.47 LED6.K
N$22
  Bottom 1.27: 152.5,40 Q18.C
  Bottom 2.54: R68.2 152.5,33.82 152.5,40
N$23
  Bottom 0.406: R46.2 37.45,90.97 LED8.K
N$24
  Bottom 0.406: R48.2 48.95,90.72 LED10.K
N$25
  Bottom 0.406: R50.2 61.95,90.97 LED12.K
N$26
  Bottom 0.406: R52.2 73.45,90.47 LED14.K
N$27
  Top 0.61: J7.1 16,23.79 16,37.75 15.07,38.67 J6.1
  Bottom 1.27: J7.1 17.02,22.18 D23.A
N$28  (via drill 0.35)
  Top 0.305: v8.75,62.25 11.53,62.25 J5.6
  Bottom 0.305: v8.75,62.25 9,62 9,50.17 J4.6 11.6,44.89 SJ2.2
N$29
  Top 1.27: F2.1 120,9.35 123,6.35 X7.2 | IC3.10 67.34,10.41 68.75,9 68.75,3.25 70,2 78.75,2 79,2.25 X8.6
  Bottom 1.27: X8.6 79,2.25 79.5,1.75 86,1.75 | 86,1.75 93.25,1.75 | 93.25,1.75 109,1.75 | 109,1.75 116,1.75 | 116,1.75 122.25,1.75 123,2.5 X7.2 | X7.4 116,1.75 | X7.6 109,1.75 | X8.4 86,1.75 | X8.2 93,2 93.25,1.75
N$30
  Bottom 0.406: R54.2 85.45,90.72 LED16.K
N$31
  Bottom 0.406: R56.2 97.2,90.47 LED18.K
N$32
  Bottom 0.61: LED22.A LED21.K R59.2
N$33
  Bottom 0.406: JP1.2 20.78,60.52 R62.2
N$34
  Bottom 0.406: Q11.B 42.93,82.7 R28.1
N$36
  Bottom 0.406: Q13.B 48.93,82.7 R34.1
N$37
  Bottom 0.406: Q15.B 54.68,82.7 R36.1
N$38
  Top 1.27: IC5.10 26,10.77 X10.4 | F3.1 X9.2
  Bottom 1.016: X9.2 63,2.75 62.25,2 56,2 | 56,2 48.75,2 | 48.75,2 33,2 | 33,2 26,2 | 26,2 19,2 X10.6 | X10.4 26,2 | X10.2 33,2 | X9.6 49,2.25 48.75,2 | X9.4 56,2
N$39
  Bottom 0.406: Q2.B 60.93,82.7 R7.1
N$40
  Bottom 0.406: Q3.B 20.09,82.54 R9.1
N$41
  Bottom 0.406: Q4.B 66.93,82.7 R10.1
N$42
  Bottom 0.61: R19.1 LED3.A
N$43
  Bottom 0.61: R1.1 LED1.A
N$44
  Bottom 0.61: R5.1 LED2.A
N$45
  Bottom 0.406: Q6.B 72.93,82.7 R18.1
N$46
  Bottom 0.406: Q8.B 78.93,82.7 R21.1
N$47
  Bottom 0.406: Q10.B 84.93,82.7 R27.1
N$48
  Bottom 0.406: Q12.B 90.93,82.45 R29.1
N$49
  Bottom 0.406: Q14.B 96.93,82.45 R35.1
N$50
  Bottom 0.406: Q16.B 102.93,82.45 R37.1
N$51
  Bottom 1.016: D22.A 17.12,15.82 15.52,15.82 15.09,15.4 13.69,15.4 13.26,15.82 J7.6 10.57,15.82 10.5,15.75 9,17.25 9,29.73 J6.6
N$52
  Top 0.61: U3.12 68.44,64.94 70.5,67 Y1.2
  Bottom 0.61: U3.12 68.44,60.29 C6.2
N$53
  Top 0.61: U3.13 65.9,65.6 64.5,67 Y1.1
  Bottom 0.61: U3.13 65.9,60.2 C7.2
N$54
  Bottom 0.61: T1.1 19.15,36.75 R66.1
N$55
  Bottom 0.61: U3.32 76,47.19 C11.1
O1
  Bottom 0.61: X10.7 15.5,6.5 16.5,7.5 27,7.5 30.13,10.63 IC5.11
O2
  Bottom 0.61: X10.5 22.5,5.5 23.5,6.5 28.1,6.5 30.16,8.56 31.07,8.56 32.67,10.17 IC5.12
O3
  Bottom 0.61: X10.3 29.75,4.85 29.75,6 31.5,7.75 34,7.75 35.21,8.96 IC5.13
O4
  Bottom 0.61: X10.1 36.5,6.25 37.75,7.5 IC5.14
O5
  Bottom 0.61: X9.7 45.5,6 45,6.5 41.75,6.5 40.29,7.96 IC5.15
O6
  Bottom 0.61: X9.5 52.5,6.5 51.5,7.5 43.5,7.5 42.83,8.17 IC5.16
O7
  Bottom 0.61: X9.3 59.5,6.75 57.75,8.5 46.75,8.5 45.37,9.88 IC5.17
O8
  Bottom 0.61: X9.1 66.5,7.75 64.75,9.5 49,9.5 47.91,10.59 IC5.18
O9
  Bottom 0.61: X8.7 69.88,10.22 IC3.11
O10
  Bottom 0.61: X8.5 82.5,6 80.75,7.75 73.5,7.75 72.5,8.75 72.5,12.36 IC3.12
O11
  Bottom 0.61: IC3.13 75,12.4 75,9.75 76,8.75 83.17,8.75 83.64,8.27 83.87,8.27 84.68,7.46 86.64,7.46 X8.3
O12
  Bottom 0.61: IC3.14 77.5,10 77.94,9.56 83.51,9.56 83.98,9.09 84.21,9.09 85.02,8.27 92.83,8.27 X8.1
O13
  Bottom 0.61: IC3.15 80.04,11.29 80,11.25 80.87,10.38 83.84,10.38 84.32,9.9 84.54,9.9 85.36,9.09 101.01,9.09 X7.7
O14
  Bottom 0.61: IC3.16 82.58,11.42 82.81,11.19 84.18,11.19 84.66,10.72 84.88,10.72 85.69,9.9 107.2,9.9 X7.5
O15
  Bottom 0.61: IC3.17 85.12,11.87 85,11.75 86,10.75 87.17,10.75 87.2,10.72 113.38,10.72 X7.3
O16
  Bottom 0.61: IC3.18 113.81,12.44 119.5,6.75 124.5,6.75 126.5,4.75 X7.1
OT1A
  Top 1.27: Q1.C 9,80.25 8.25,81 8.25,87.5 9.75,89 9.75,92.75 11.9,94.9 X2.1
  Bottom 0.406: R42.1 11.3,94.2 X2.1
  Bottom 1.27: D2.A 12,96.45 X2.1
OT1B
  Top 1.27: X2.3 20.25,93.65 20.25,80.75 19.75,80.25 Q3.C
  Bottom 0.406: X2.3 20.2,93.7 R43.1
  Bottom 1.27: D4.A 19,96.95 X2.3
OT2A
  Top 1.27: Q5.C 23.25,80 21.86,81.39 21.86,94.22 22.5,94.86 X2.4
  Bottom 0.406: X2.4 22.8,94.6 R44.1
  Bottom 1.27: D6.A 22.5,97.2 X2.4
OT2B
  Top 1.27: Q7.C 28.25,80 27.78,80.47 27.78,93.18 X2.6
  Bottom 0.406: X2.6 30.45,93.95 R45.1
  Bottom 1.27: D8.A 29.5,96.2 X2.6
OT3A
  Top 1.27: Q9.C 34.75,80 34.11,80.64 34.11,92.51 X5.1
  Bottom 0.406: R46.1 35.55,93.95 X5.1
  Bottom 1.27: D10.A 36.5,96.2 X5.1
OT3B
  Top 1.27: Q11.C 40.5,80 40.03,80.47 40.03,91.43 41.17,92.58 X5.3
  Bottom 0.406: R47.1 43.45,94.85 X5.3
  Bottom 1.016: D12.A 43.45,97.15 43.45,94.85
OT4A
  Top 1.27: Q13.C 47,80 46.11,80.89 46.11,94.01 X5.4
  Bottom 0.406: R48.1 47.05,94.85 X5.4
  Bottom 1.27: D14.A 47,97.2 X5.4
OT4B
  Top 1.27: Q15.C 52.5,80 51.86,80.64 51.86,92.76 X5.6
  Bottom 0.406: X5.6 54.95,93.95 R49.1
  Bottom 1.27: D16.A 54,96.2 X5.6
OT5A
  Top 1.27: Q2.C 58.75,80 58.11,80.64 58.11,92.01 X3.1
  Bottom 0.406: X3.1 60.05,93.95 R50.1
  Bottom 1.27: D3.A 61,96.2 X3.1
OT5B
  Top 1.27: Q4.C 64.75,80 64.11,80.64 64.11,91.01 X3.3
  Bottom 0.406: X3.3 68,92.45 R51.1
  Bottom 1.27: D5.A 68,96.95 X3.3
OT6A
  Top 1.27: Q6.C 70.11,80 70.11,93.51 X3.4
  Bottom 0.406: X3.4 71.5,92.3 R52.1
  Bottom 1.27: D7.A 71.5,97.2 X3.4
OT6B
  Top 1.27: Q8.C 76.22,80 76.11,80.1 76.11,92.51 X3.6
  Bottom 0.406: X3.6 79.45,93.95 R53.1
  Bottom 1.27: D9.A 78.5,96.2 X3.6
OT7A
  Top 1.27: Q10.C 82.75,80 82.11,80.64 82.11,92.51 X6.1
  Bottom 0.406: R54.1 83.55,93.95 X6.1
  Bottom 1.27: D11.A 84.5,96.2 X6.1
OT7B
  Top 1.27: Q12.C 88.75,79.75 88.11,80.39 88.11,91.51 X6.3
  Bottom 0.406: X6.3 91.7,94.7 R55.1
  Bottom 1.27: D13.A 91.5,96.95 X6.3
OT8A
  Top 1.27: Q14.C 95,79.75 93.75,81 93.75,93.65 X6.4
  Bottom 0.406: X6.4 95,92.55 R56.1
  Bottom 1.27: D15.A 95,97.2 X6.4
OT8B
  Top 1.27: Q16.C 100.75,79.75 100,80.5 100,92.9 X6.6
  Bottom 0.406: X6.6 102.95,93.95 R57.1
  Bottom 1.27: D17.A 102,96.2 X6.6
RED
  Bottom 0.406: U3.39 93.84,45.09 92.75,44 92.73,44.02 LED1.K
RESET  (via drill 0.35)
  Top 0.2: IC4.6 37.98,29.29 74.46,29.29 74.75,29 v74.75,29.02
  Bottom 0.2: J1.5 78.46,69.55 77.17,68.26 | v74.75,29.02 75.21,29.48 IC1.6 75.21,42.46 77.25,44.5 77.25,48.5 78.16,49.41 78.16,60.63
  Bottom 0.203: 78.16,60.63 77.98,60.81 77.62,60.81 U3.9
  Bottom 0.254: C17.2 75.75,65.5 | 75.75,65.5 75.75,62.68 U3.9 | 77.17,68.26 77.17,66.92 75.75,65.5
RXD
  Bottom 0.203: U3.14 63.36,71.78 J2.3
SCL
  Top 0.305: IC1.1 87.91,32.84 86.75,34 84.75,34 84.25,33.5 84.25,31.25 83.44,30.44 49.53,30.44 IC4.1 50.1,34.25 J3.1
  Bottom 0.305: IC4.1 47.91,34.69 D19.1 | 50.66,42.34 50.66,34.59 51,34.25 J3.1
  Bottom 0.406: U3.22 50.66,42.34 | IC1.1 87.91,29.61 R60.1
SDA
  Top 0.305: IC1.2 85.5,31.93 85.5,30 85.25,29.75 46.25,29.75 45.37,30.63 IC4.2 45.37,32.87 48.75,36.25 J3.2
  Bottom 0.305: IC4.2 45.37,34.47 D19.2 | 53.2,42.05 53.2,40.7 53.24,40.66 53.24,37.24 J3.2
  Bottom 0.406: U3.23 53.2,42.05 | IC1.2 85.37,29.32 R61.1
T1F  (via drill 0.5)
  Top 2.54: v133.5,26.75 133.25,27 133.25,83.65 X11.9 | F1.2 147.5,26.25 v147.25,26.5
  Bottom 0.61: LED22.K LED21.A 148.52,20.02 147.5,19 F1.2
  Bottom 2.54: v147.25,26.5 133.75,26.5 v133.5,26.75 | X11.15 X11.13 X11.11 X11.9 X11.7 X11.5 X11.3 X11.1
TRACK1
  Top 2.54: F1.1 147.5,5.12 X1.1
  Bottom 0.61: R4.2 119,27.75 123,23.75 140.25,23.75 144.25,19.75 144.25,13.75 145.29,12.71 F1.1
TRACK2  (via drill 0.35)
  Top 0.61: 142.81,30.25 142.81,31.31 v143,31.5
  Top 2.54: X1.2 142.81,30.25 | X11.4 141,92.25 144.25,89 147.75,89 150.25,86.5 150.25,80.5 148.25,78.5 143.5,78.5 142,77 142,32.5 v143,31.5
  Bottom 0.406: OK1.3 100.79,31.25 103.5,31.25 D1.A 104.5,30.3 141.8,30.3 v143,31.5
  Bottom 0.508: X1.2 142.81,7.31 143.75,8.25 149.5,8.25 152,10.75 R59.1
  Bottom 0.61: OK1.3 98.57,30.52 C1.2
  Bottom 2.54: X11.16 X11.14 X11.12 X11.10 X11.8 X11.6 X11.4 X11.2
TXD
  Bottom 0.203: U3.15 61.04,62.59 J2.2
XP_12V  (via drill 0.35)
  Top 1.016: v17.25,63.5 16.66,63.59 J5.5
  Bottom 1.27: R63.2 20.7,56.75 18.25,56.75 | J4.5 17.16,48.84 17.2,48.8 | 17.2,48.8 17.25,48.75 18.25,49.75 18.25,56.75 | v17.25,63.5 17.75,63 17.75,57.25 18.25,56.75 | D21.A 17.96,42 17.2,42.56 17.2,48.8
XP_DIR  (via drill 0.35)
  Top 0.2: U3.36 84.71,45.62 84.34,45.62 84.21,45.5 v79.75,45.5 | v79,59.5 78.64,59.5 78.49,59.34 35.41,59.34 v35,59.75
  Bottom 0.2: IC2.2 34.62,60.38 35,60 v35,59.75 35,59.5 34.62,59.12 IC2.3 | v79.75,45.5 79.75,46.59 79.79,46.63 79.79,58.71 v79,59.5
XP_RX  (via drill 0.35)
  Top 0.2: v35.25,61.25 47.55,61.25 47.62,61.18 51.16,61.18 51.48,61.5 52.45,61.5 52.78,61.18 57.09,61.18 U3.16
  Bottom 0.2: IC2.1 34.59,61.66 35,61.25 v35.25,61.25
XP_TX  (via drill 0.35)
  Top 0.2: v55.75,58 35.5,58 v35.25,57.75
  Bottom 0.2: IC2.4 32.63,57.87 32.75,57.75 v35.25,57.75 | U3.17 v55.74,58.01 v55.75,58
XPA  (via drill 0.35)
  Top 0.406: v19.25,58.75 v10,58.75
  Bottom 0.2: D20.2 11.41,65.05 J5.4
  Bottom 0.305: J4.4 11.38,50.12 10,51.5 v10,58.75 10,63.27 J5.4
  Bottom 0.406: IC2.6 24.89,59.12 JP1.1 23.03,58.7 R63.1 20.7,58.75 v19.25,58.75
XPB  (via drill 0.35)
  Top 0.305: J5.3 16.61,66.14 v16.75,66
  Bottom 0.2: J5.3 8.91,66.14 D20.1
  Bottom 0.305: J4.3 15.75,52.99 15.75,54.68 16.36,55.28 16.36,62.93 16.21,63.07 16.21,64.61 16.75,65.14 v16.75,66
  Bottom 0.406: R62.1 20.75,62.75 | 20.75,62.75 R64.2 19.45,64.3 17.75,66 v16.75,66 | IC2.7 25.86,60.38 25.75,60.5 25.75,62 25.25,62.5 21,62.5 20.75,62.75

### Text on the board
tPlace: DCC- | DCC+ | 0V | Term | XPressnet | Address | Learn | I2C | Loconet | O1 | O9 | O10 | O11 | O12 | O13 | O14 | O2 | O3 | O4 | O5 | O6 | O7 | O8 | O15 | O16
tNames: D1 | 0V | D2 | D3 | 0V | D4 | 1 | 2 | 3 | 4 | 5 | 6 | CDU | +18V | DCC Accessory Board / Rev 1.5 / May 2019 | 5V Ok | Fault | Status | +18V | DCC- | DCC+ | 0V